# EAGLE design VIVA PIC16 with battery (EAGLE 6.3)

## Sheet 1 of 8
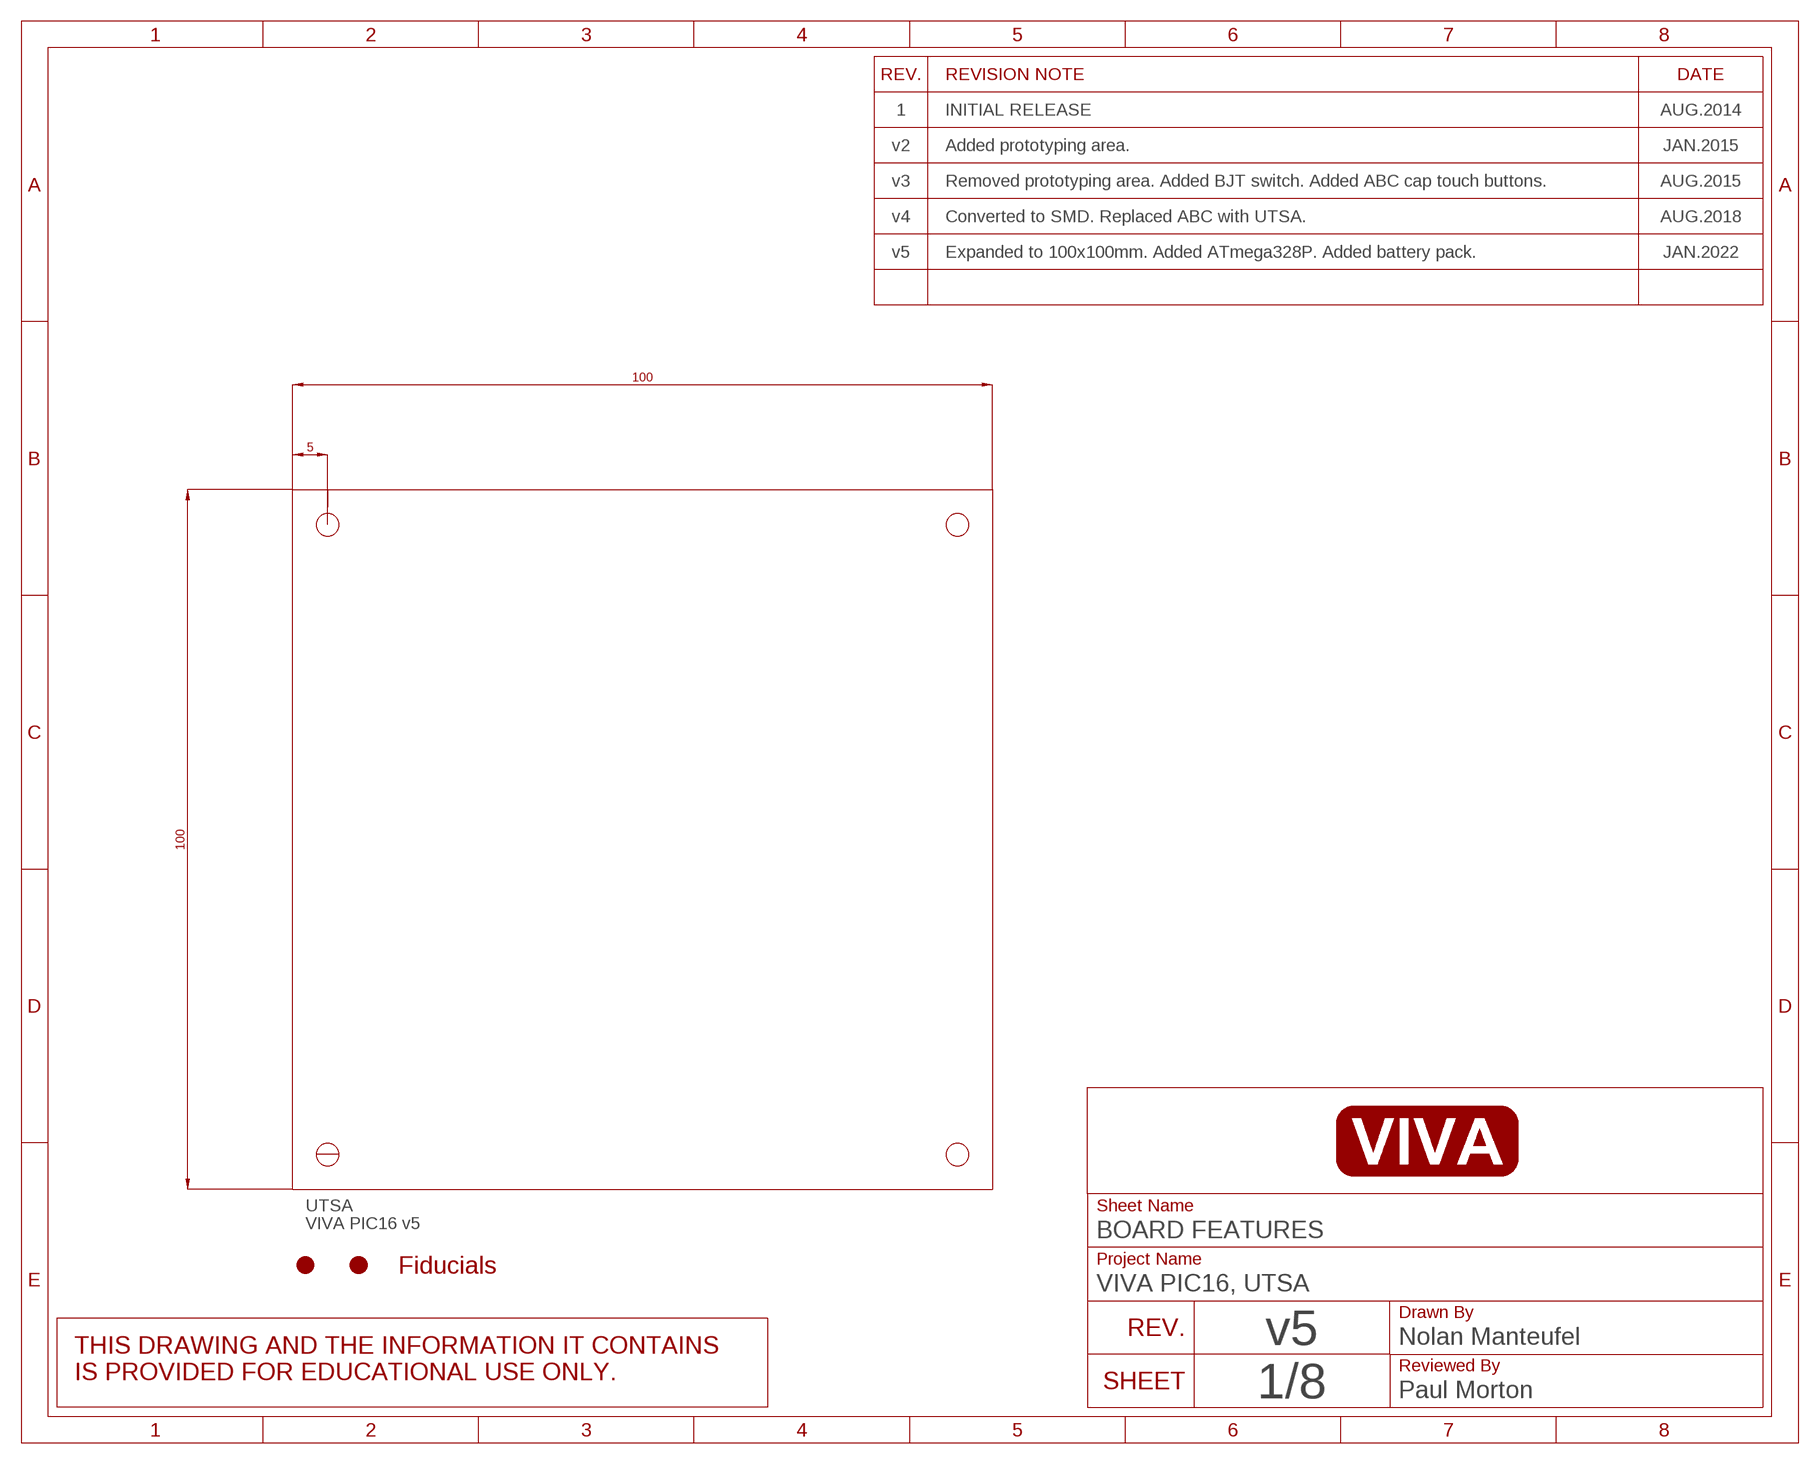
[diagram p0: schematic, sheet 1]
U$1 (SCHEMATIC_VIVA): DRAWN_BY: Nolan Manteufel; PROJECT: VIVA PIC16, UTSA; REVA: 1; REVA_DATE: AUG.2014; REVA_NOTE: INITIAL RELEASE; REVB: v2; REVB_DATE: JAN.2015; REVB_NOTE: Added prototyping area.; REVC: v3; REVC_DATE: AUG.2015; REVC_NOTE: Removed prototyping area. Added BJT switch. Added ABC cap touch buttons.; REVD: v4; REVD_DATE: AUG.2018; REVD_NOTE: Converted to SMD. Replaced ABC with UTSA.; REVE: v5; REVE_DATE: JAN.2022; REVE_NOTE: Expanded to 100x100mm. Added ATmega328P. Added battery pack.; REVIEWED_BY: Paul Morton; REVISION: v5

### Parts
FIDUCIAL1  FIDUCIAL  [FIDUCIAL]
FIDUCIAL2  FIDUCIAL  [FIDUCIAL]
UTSA  VIVA PIC16 v5  PCB_100X100  [PCB_100X100]

### Notes on the sheet
- Fiducials

## Sheet 2 of 8
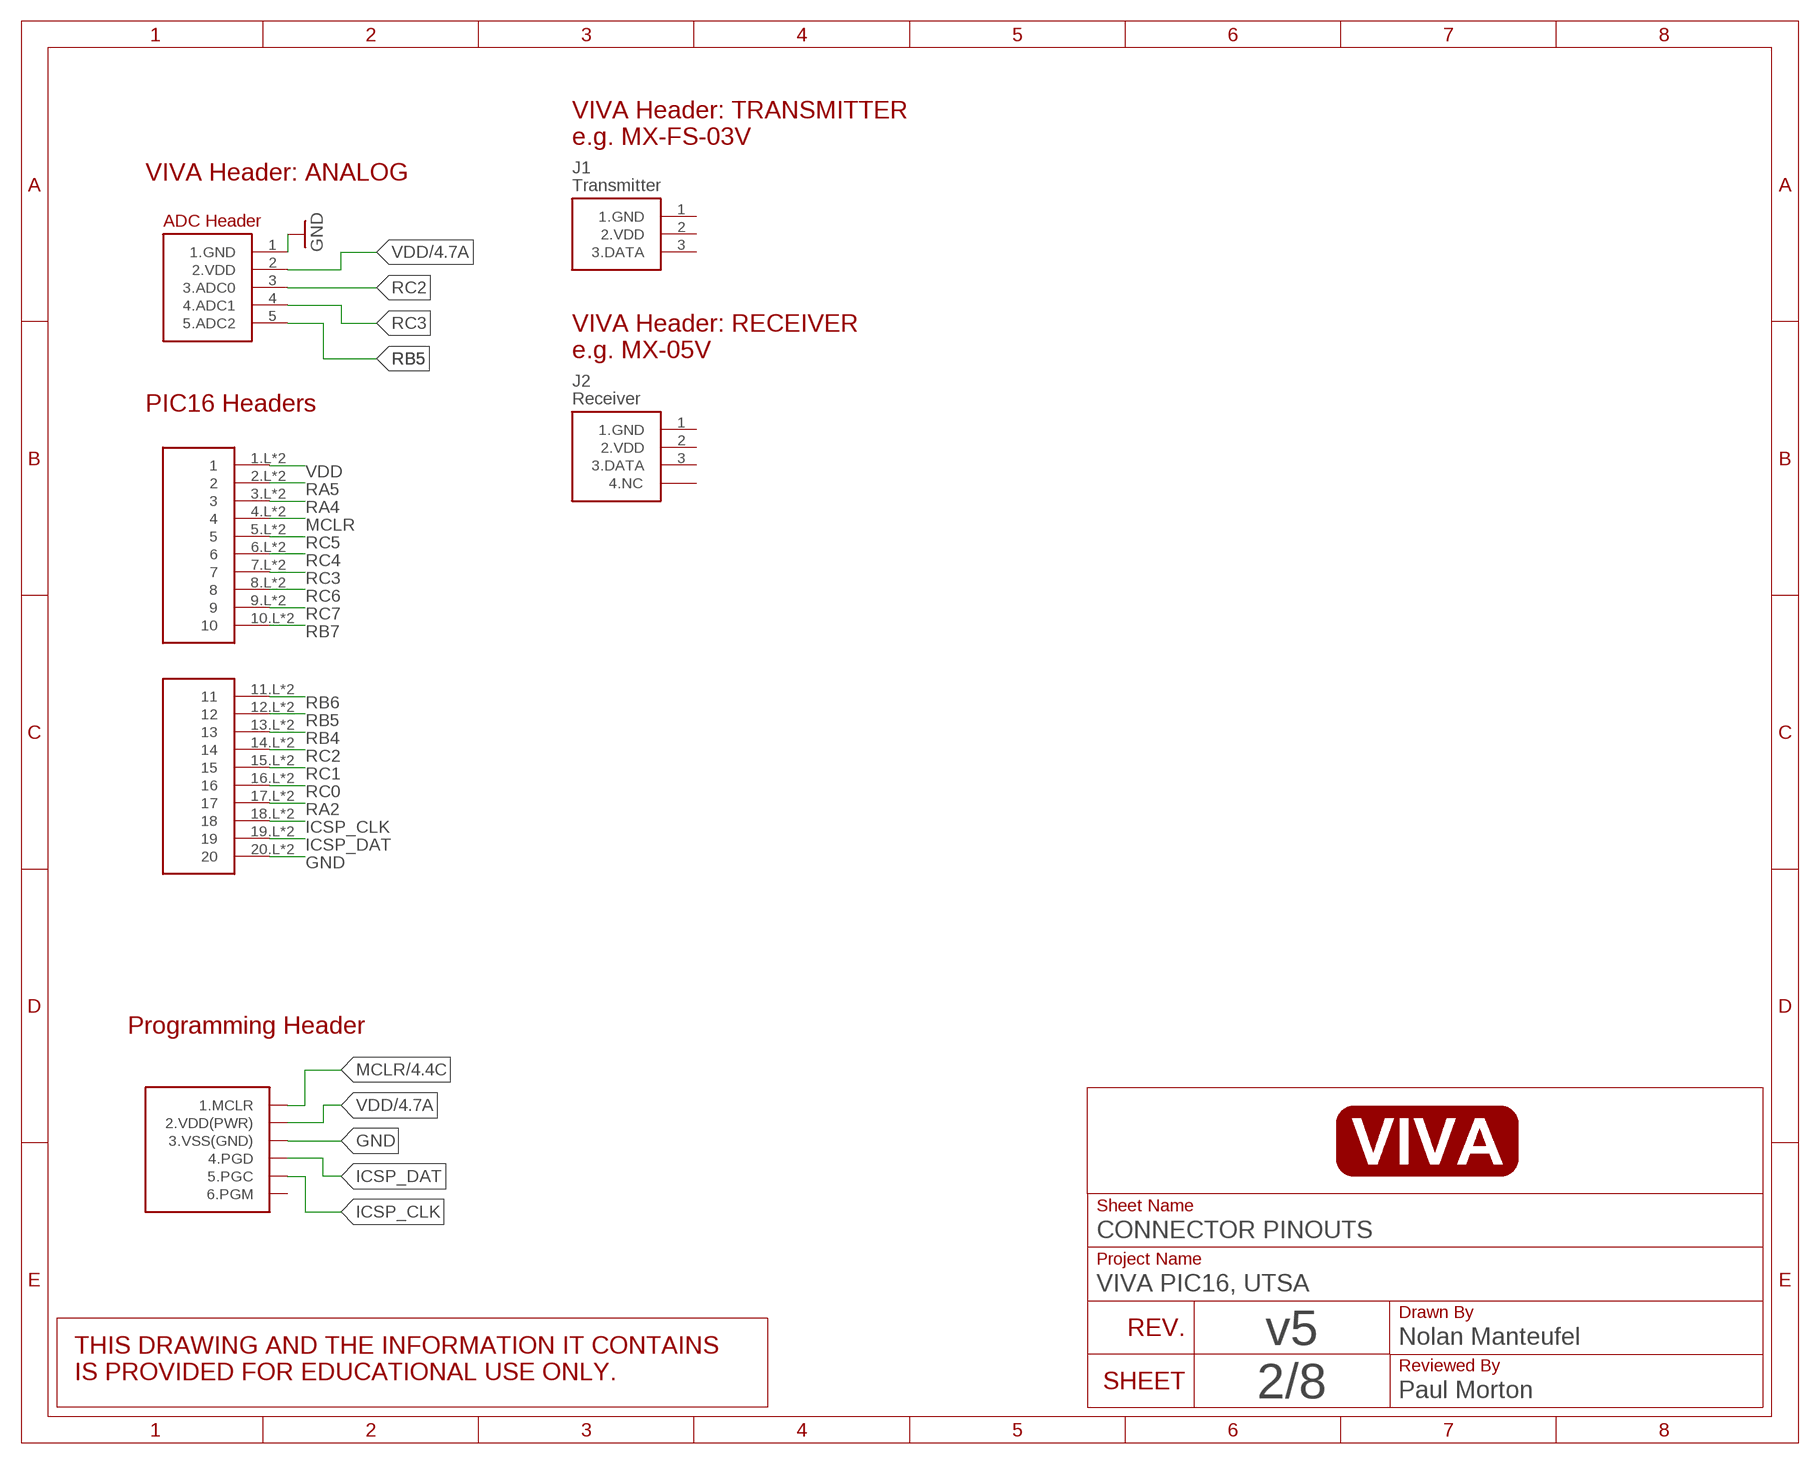
[diagram p1: schematic, sheet 2]
U$2 (SCHEMATIC_VIVA): DRAWN_BY: Nolan Manteufel; PROJECT: VIVA PIC16, UTSA; REVA: 1; REVA_DATE: AUG.2014; REVA_NOTE: INITIAL RELEASE; REVB: v2; REVB_DATE: JAN.2015; REVB_NOTE: Added prototyping area.; REVC: v3; REVC_DATE: AUG.2015; REVC_NOTE: Removed prototyping area. Added BJT switch. Added ABC cap touch buttons.; REVD: v4; REVD_DATE: AUG.2018; REVD_NOTE: Converted to SMD. Replaced ABC with UTSA.; REVE: v5; REVE_DATE: JAN.2022; REVE_NOTE: Expanded to 100x100mm. Added ATmega328P. Added battey pack.; REVIEWED_BY: Paul Morton; REVISION: v5

### Parts
J1  Transmitter  VIVA-HEADER-GPIO-1  [VIVA-HEADER-GPIO-RA-1]
J2  Receiver  VIVA-HEADER-RF-RX  [VIVA-HEADER-RF-RX]
J202  VIVA-HEADER-ADCNONAME  [VIVA-HEADER-ADC-NONAME]
J203  PICKIT3  [PICKIT3]
U$6  VIVA_PIC16BOARD  [VIVA_PIC16]

### Nets
GND: J202.1(1.GND) J203.3(3.VSS(GND)) U$6.20.L U$6.20.R ; also sheet 3,4
ICSP_CLK: J203.5(5.PGC) U$6.18.L U$6.18.R ; also sheet 4
ICSP_DAT: J203.4(4.PGD) U$6.19.L U$6.19.R ; also sheet 4
MCLR: J203.1(1.MCLR) U$6.4.L U$6.4.R ; also sheet 4
RA2: U$6.17.L U$6.17.R ; also sheet 4
RA4: U$6.3.L U$6.3.R ; also sheet 4
RA5: U$6.2.L U$6.2.R ; also sheet 4
RB4: U$6.13.L U$6.13.R ; also sheet 4
RB5: J202.5(5.ADC2) U$6.12.L U$6.12.R ; also sheet 4
RB6: U$6.11.L U$6.11.R ; also sheet 4
RB7: U$6.10.L U$6.10.R ; also sheet 4
RC0: U$6.16.L U$6.16.R ; also sheet 4
RC1: U$6.15.L U$6.15.R ; also sheet 4
RC2: J202.3(3.ADC0) U$6.14.L U$6.14.R ; also sheet 4
RC3: J202.4(4.ADC1) U$6.7.L U$6.7.R ; also sheet 4
RC4: U$6.6.L U$6.6.R ; also sheet 4
RC5: U$6.5.L U$6.5.R ; also sheet 4
RC6: U$6.8.L U$6.8.R ; also sheet 4
RC7: U$6.9.L U$6.9.R ; also sheet 4
VDD: J202.2(2.VDD) J203.2(2.VDD(PWR)) U$6.1.L U$6.1.R ; also sheet 4
Unconnected: J1.1(1.GND) J1.2(2.VDD) J1.3(3.DATA) J2.1(1.GND) J2.2(2.VDD) J2.3(3.DATA) J203.6(6.PGM)

### Notes on the sheet
- VIVA Header: TRANSMITTER
  e.g. MX-FS-03V
- VIVA Header: ANALOG
- VIVA Header: RECEIVER
  e.g. MX-05V
- PIC16 Headers
- Programming Header

## Sheet 3 of 8
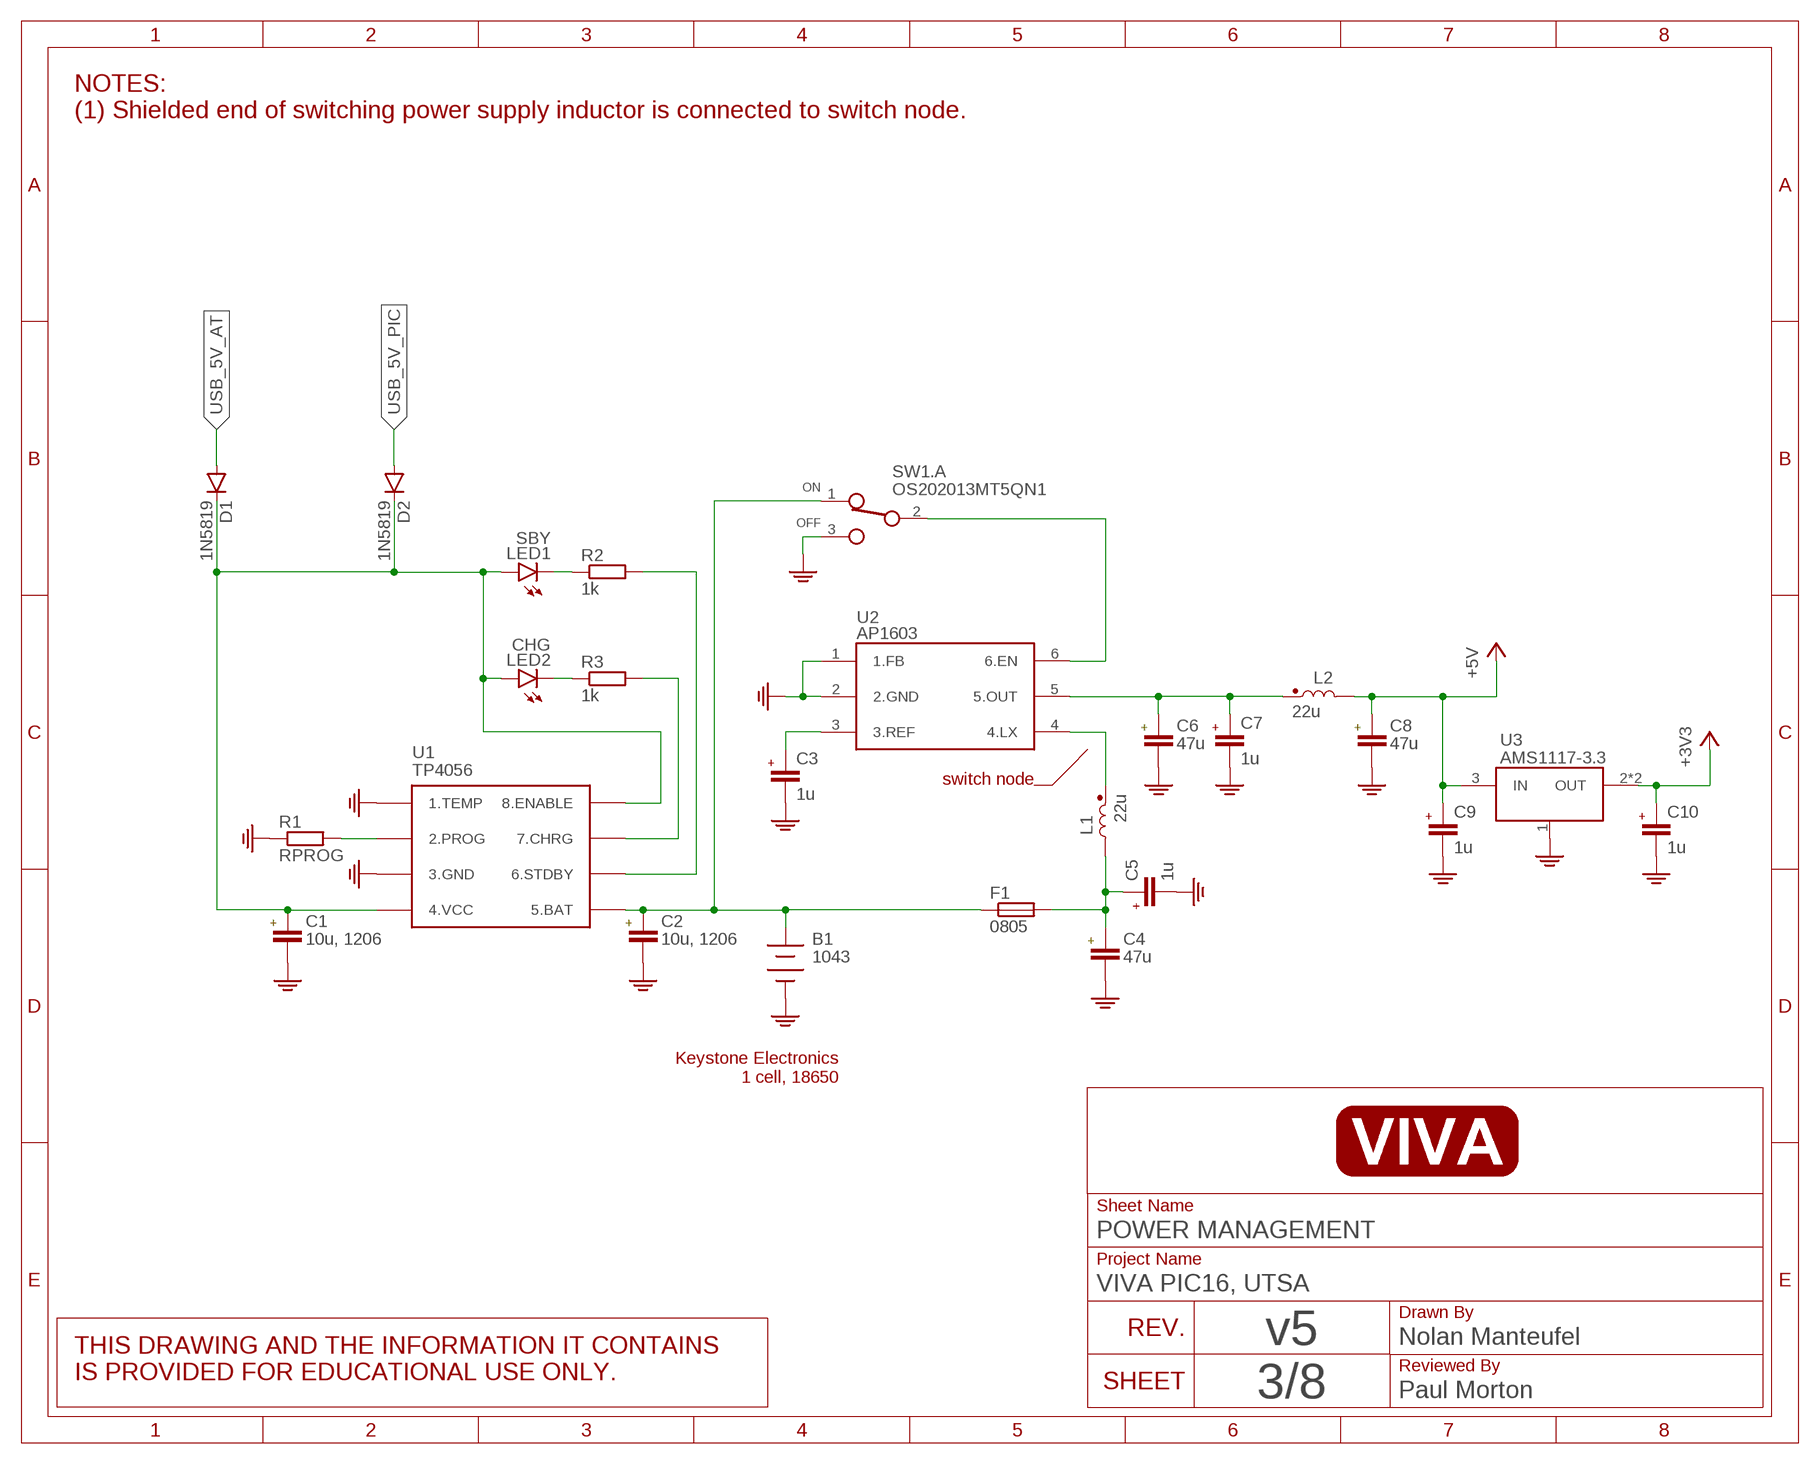
[diagram p2: schematic, sheet 3]
U$3 (SCHEMATIC_VIVA): DRAWN_BY: Nolan Manteufel; PROJECT: VIVA PIC16, UTSA; REVA: 1; REVA_DATE: AUG.2014; REVA_NOTE: INITIAL RELEASE; REVB: v2; REVB_DATE: JAN.2015; REVB_NOTE: Added prototyping area.; REVC: v3; REVC_DATE: AUG.2015; REVC_NOTE: Removed prototyping area. Added BJT switch. Added ABC cap touch buttons.; REVD: v4; REVD_DATE: AUG.2018; REVD_NOTE: Converted to SMD. Replaced ABC with UTSA.; REVE: v5; REVE_DATE: JAN.2022; REVE_NOTE: Expanded to 100x100mm. Added ATmega328P. Added battey pack.; REVIEWED_BY: Paul Morton; REVISION: v5

### Parts
B1  1043  BATTERY18650  [BATTERY-18650-1]
C1  10u, 1206  C-EUC1206  [C1206]
C2  10u, 1206  C-EUC1206  [C1206]
C3  1u  C0805  [C0805]
C4  47u  C-EU865080642006  [C-WE-5MM]
C5  1u  C0805  [C0805]
C6  47u  C-EU865080642006  [C-WE-5MM]
C7  1u  C0805  [C0805]
C8  47u  C-EU865080642006  [C-WE-5MM]
C9  1u  C0805  [C0805]
C10  1u  C0805  [C0805]
D1  1N5819  DIODE-SOD80C  [SOD80C]
D2  1N5819  DIODE-SOD80C  [SOD80C]
F1  0805  FUSE0805  [F0805]
L1  22u  L5040  [SRN5040]
L2  22u  L5040  [SRN5040]
LED1  SBY  LEDCHIPLED_0603  [CHIPLED_0603]
LED2  CHG  LEDCHIPLED_0603  [CHIPLED_0603]
R1  RPROG  R-EU__R0805  [R0805]
R2  1k  R-EU__R0805  [R0805]
R3  1k  R-EU__R0805  [R0805]
SW1.  OS202013MT5QN1  SWITCH_DPDT  [OS202013MT5QN1]
U1  TP4056  [SO08-THERMAL]
U2  AP1603  [SOT23-6]
U3  AMS1117-3.3  REGULATOR_SCHLM1117  [SOT223]

### Nets
+3V3: C10.2(+) U3.2(OUT) U3.4.TAB(OUT)
+5V: C8.1+ C9.2(+) L2.1 U3.3(IN)
B+: B1.+ C2.+ F1.1 SW1..1(A:ON) U1.5(5.BAT)
B+_FUSED: C4.1+ C5.2(+) F1.2 L1.1
CHARGE: R3.2 U1.7(7.CHRG)
DCDC_ENABLE: SW1..2(A:IN) U2.6(6.EN)
DCDC_OUT: C6.1+ C7.2(+) L2.2 U2.5(5.OUT)
DCDC_REF: C3.2(+) U2.3(3.REF)
GND: B1.1(-) C1.- C2.- C3.1(-) C4.2- C5.1(-) C6.2- C7.1(-) C8.2- C9.1(-) C10.1(-) R1.1 SW1..3(A:OFF) U1.1(1.TEMP) U1.3(3.GND) U1.THERMAL(3.GND) U2.1(1.FB) U2.2(2.GND) U3.1(GND) ; also sheet 2,4
N$2: LED1.C R2.1
N$3: LED2.C R3.1
N$7: R1.2 U1.2(2.PROG)
STANDBY: R2.2 U1.6(6.STDBY)
SWITCH_NODE: L1.2 U2.4(4.LX)
USB_5V_AT: D1.A
USB_5V_PIC: D2.A
VCC: C1.+ D1.C D2.C LED1.A LED2.A U1.4(4.VCC) U1.8(8.ENABLE)
Unconnected: SW1..4(B:ON) SW1..5(B:IN) SW1..6(B:OFF)

### Notes on the sheet
- NOTES:
  (1) Shielded end of switching power supply inductor is connected to switch node.
- switch node
- Keystone Electronics
  1 cell, 18650

## Sheet 4 of 8
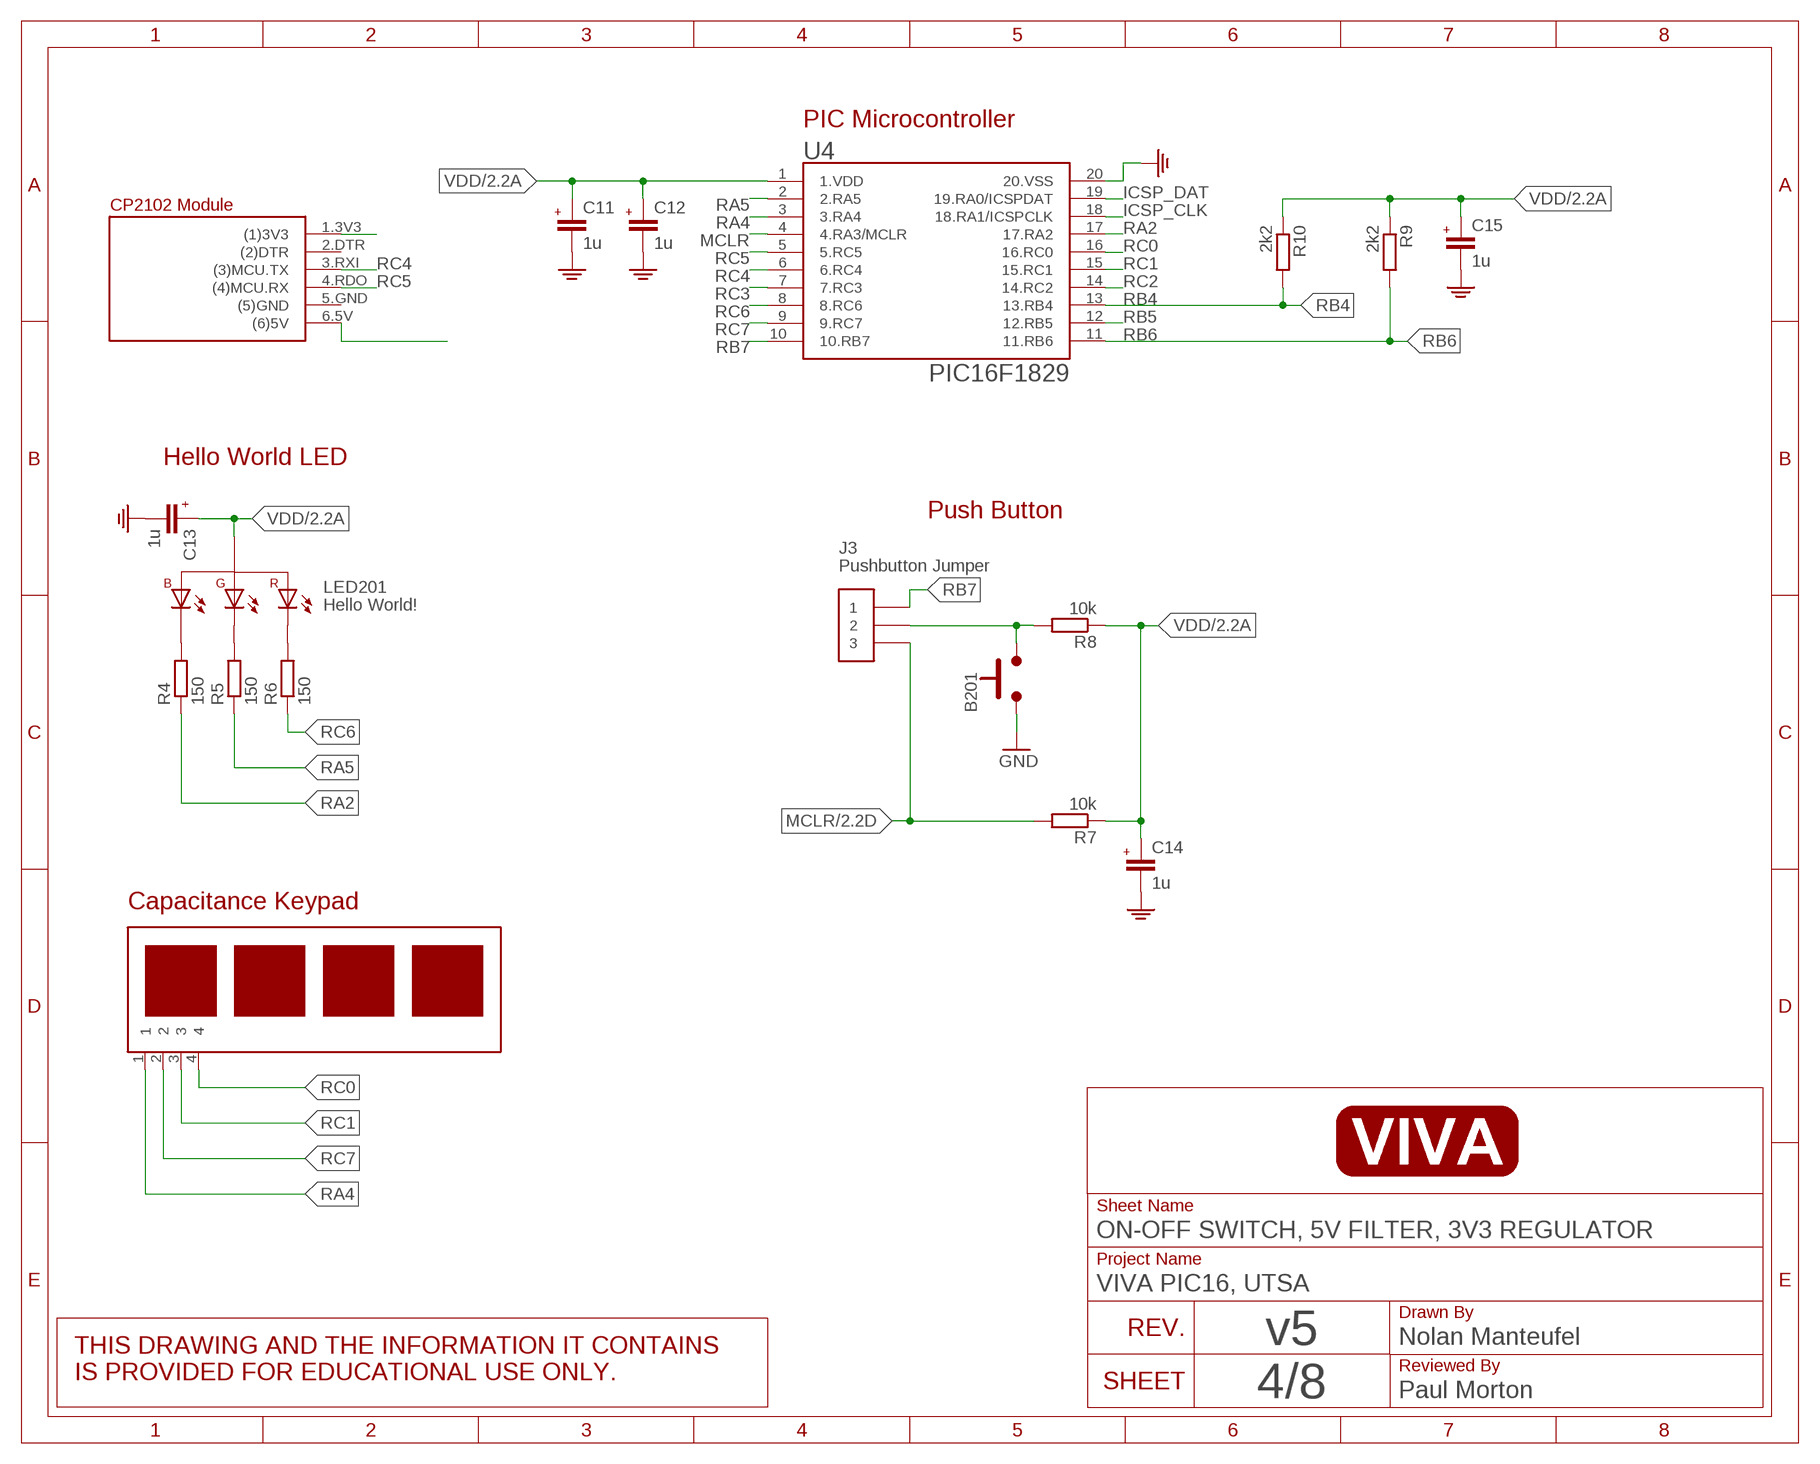
[diagram p3: schematic, sheet 4]
U$4 (SCHEMATIC_VIVA): DRAWN_BY: Nolan Manteufel; PROJECT: VIVA PIC16, UTSA; REVA: 1; REVA_DATE: AUG.2014; REVA_NOTE: INITIAL RELEASE; REVB: v2; REVB_DATE: JAN.2015; REVB_NOTE: Added prototyping area.; REVC: v3; REVC_DATE: AUG.2015; REVC_NOTE: Removed prototyping area. Added BJT switch. Added ABC cap touch buttons.; REVD: v4; REVD_DATE: AUG.2018; REVD_NOTE: Converted to SMD. Replaced ABC with UTSA.; REVE: v5; REVE_DATE: JAN.2022; REVE_NOTE: Expanded to 100x100mm. Added ATmega328P. Added battey pack.; REVIEWED_BY: Paul Morton; REVISION: v5

### Parts
B201  PUSHBUTTON6X6MM  [6X6MM]
C11  1u  C0805  [C0805]
C12  1u  C0805  [C0805]
C13  1u  C0805  [C0805]
C14  1u  C0805  [C0805]
C15  1u  C0805  [C0805]
J3  Pushbutton Jumper  PINS_3_2.54  [PINS_3]
LED201  Hello World!  RGB_LED  [LED_RGB-5050]
R4  150  R-EU__R0805  [R0805]
R5  150  R-EU__R0805  [R0805]
R6  150  R-EU__R0805  [R0805]
R7  10k  R-EU__R0805  [R0805]
R8  10k  R-EU__R0805  [R0805]
R9  2k2  R-EU__R0805  [R0805]
R10  2k2  R-EU__R0805  [R0805]
U4  PIC16F1829  PIC16F1829300  [SOP20-NEW]
U$7  VIVA_UTSA-KEYPADV5  [VIVA_UTSA-KEYPAD-V5]
U$11  VIVA_USB-TTL  [VIVA_USB_TTL_SUBTEXT]

### Nets
GND: B201.1.A B201.2.A C11.1(-) C12.1(-) C13.1(-) C14.1(-) C15.1(-) U4.20(20.VSS) ; also sheet 2,3
ICSP_CLK: U4.18(18.RA1/ICSPCLK) ; also sheet 2
ICSP_DAT: U4.19(19.RA0/ICSPDAT) ; also sheet 2
MCLR: J3.3 R7.2 U4.4(4.RA3/MCLR) ; also sheet 2
N$1: B201.3.B B201.4.B J3.2 R8.2
N$4: LED201.2.G- R5.2
N$5: LED201.1.R- R6.2
N$6: LED201.4.B- R4.2
N$14: U$11.1.3V3((1)3V3)
N$16: U$11.6.5V((6)5V)
RA2: R4.1 U4.17(17.RA2) ; also sheet 2
RA4: U4.3(3.RA4) U$7.1 ; also sheet 2
RA5: R5.1 U4.2(2.RA5) ; also sheet 2
RB4: R10.2 U4.13(13.RB4) ; also sheet 2
RB5: U4.12(12.RB5) ; also sheet 2
RB6: R9.2 U4.11(11.RB6) ; also sheet 2
RB7: J3.1 U4.10(10.RB7) ; also sheet 2
RC0: U4.16(16.RC0) U$7.4 ; also sheet 2
RC1: U4.15(15.RC1) U$7.3 ; also sheet 2
RC2: U4.14(14.RC2) ; also sheet 2
RC3: U4.7(7.RC3) ; also sheet 2
RC4: U4.6(6.RC4) U$11.3.RXI((3)MCU.TX) ; also sheet 2
RC5: U4.5(5.RC5) U$11.4.RDO((4)MCU.RX) ; also sheet 2
RC6: R6.1 U4.8(8.RC6) ; also sheet 2
RC7: U4.9(9.RC7) U$7.2 ; also sheet 2
VDD: C11.2(+) C12.2(+) C13.2(+) C14.2(+) C15.2(+) LED201.3.+ R7.1 R8.1 R9.1 R10.1 U4.1(1.VDD) ; also sheet 2
Unconnected: U$11.2.DTR((2)DTR) U$11.5.GND((5)GND)

### Notes on the sheet
- PIC Microcontroller
- Hello World LED
- Push Button
- Capacitance Keypad

## Sheet 5 of 8
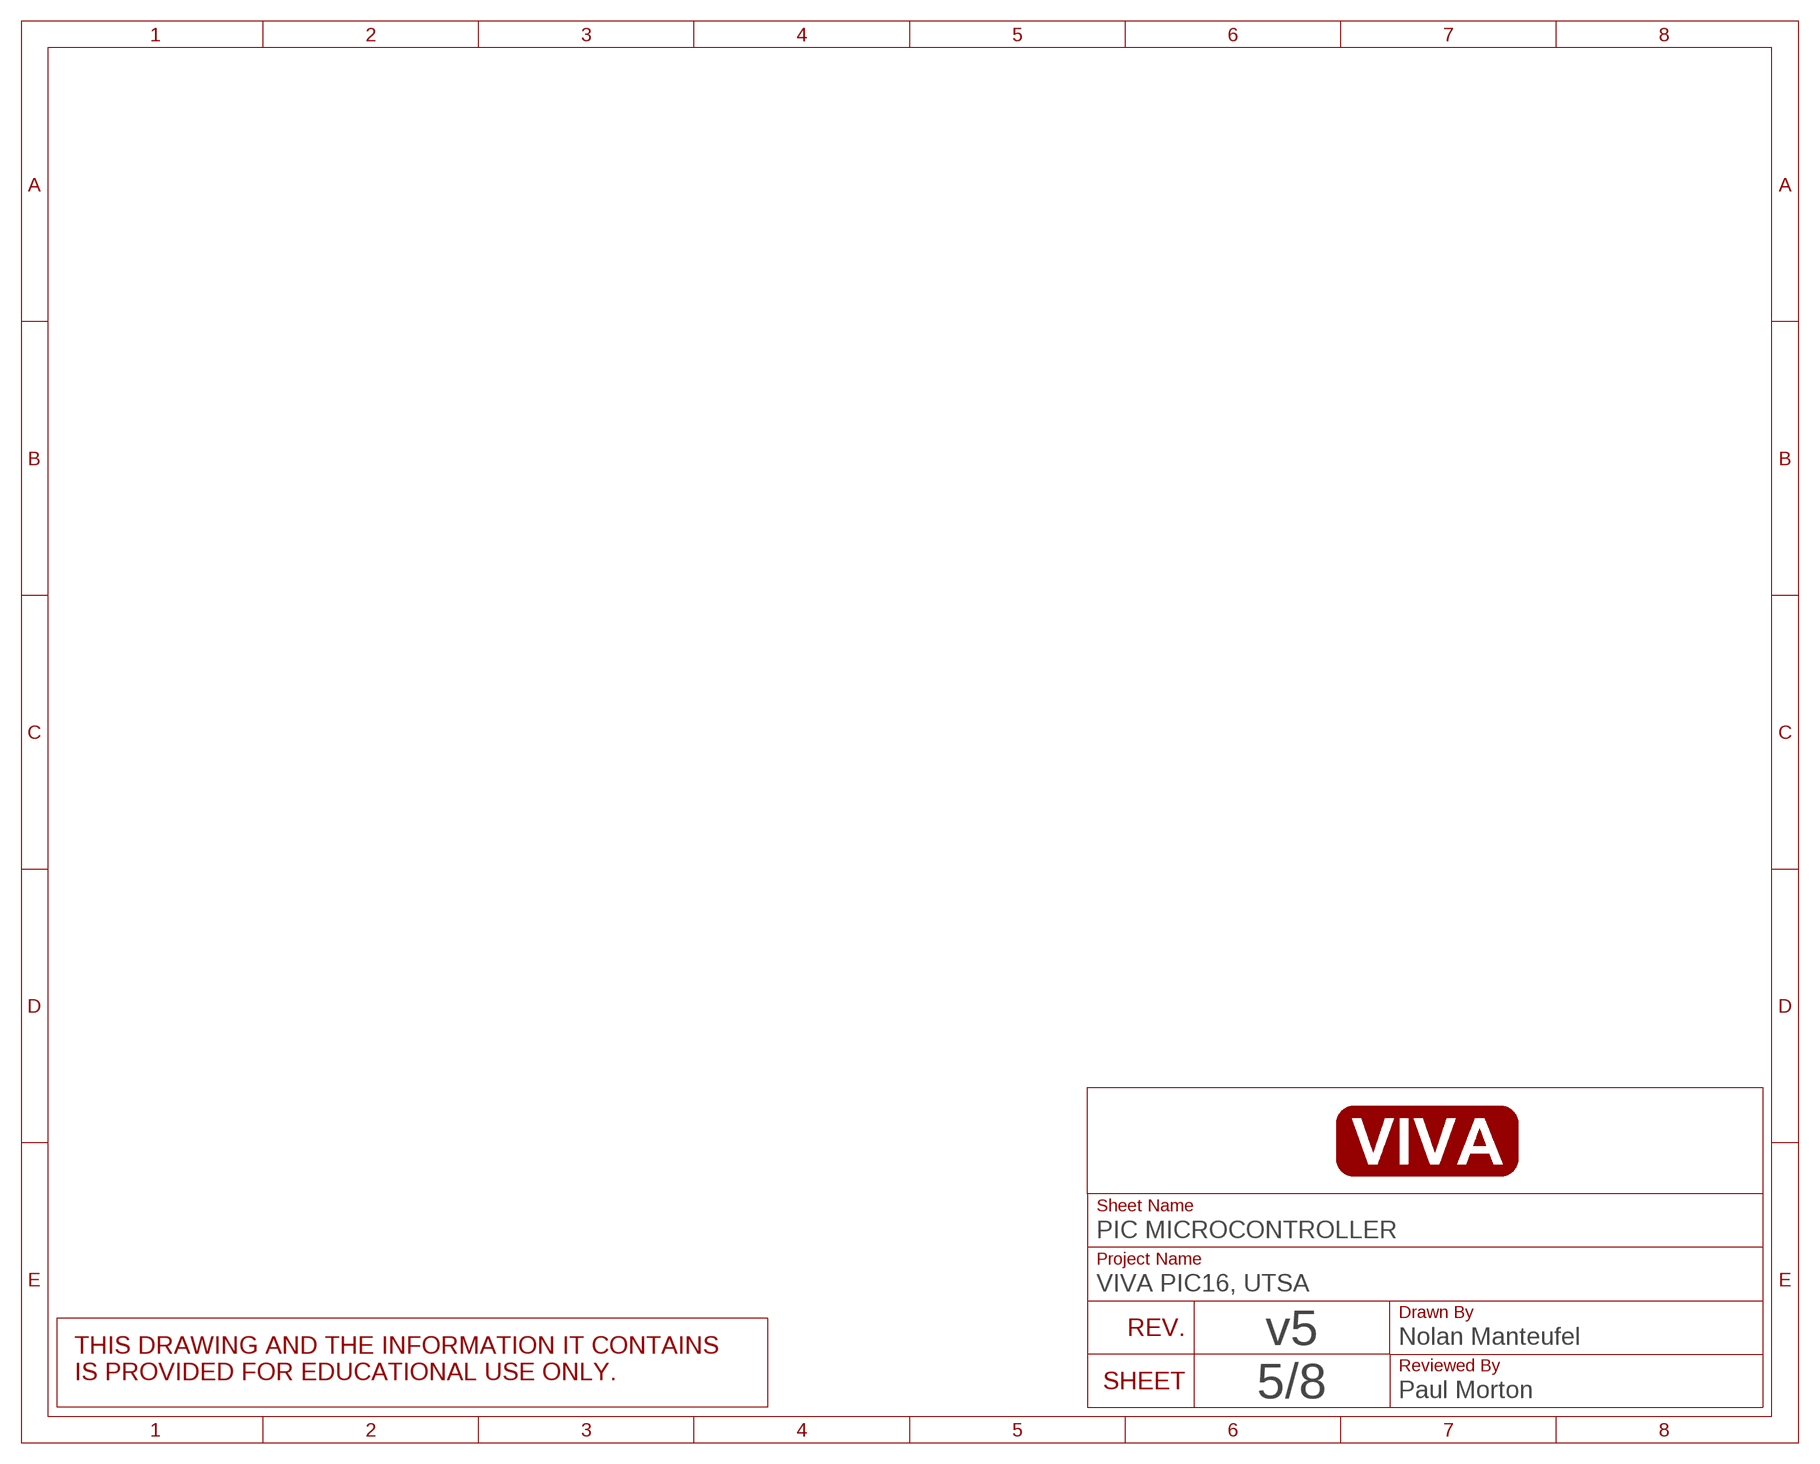
[diagram p4: schematic, sheet 5]
U$5 (SCHEMATIC_VIVA): DRAWN_BY: Nolan Manteufel; PROJECT: VIVA PIC16, UTSA; REVA: 1; REVA_DATE: AUG.2014; REVA_NOTE: INITIAL RELEASE; REVB: v2; REVB_DATE: JAN.2015; REVB_NOTE: Added prototyping area.; REVC: v3; REVC_DATE: AUG.2015; REVC_NOTE: Removed prototyping area. Added BJT switch. Added ABC cap touch buttons.; REVD: v4; REVD_DATE: AUG.2018; REVD_NOTE: Converted to SMD. Replaced ABC with UTSA.; REVE: v5; REVE_DATE: JAN.2022; REVE_NOTE: Expanded to 100x100mm. Added ATmega328P. Added battey pack.; REVIEWED_BY: Paul Morton; REVISION: v5

## Sheet 6 of 8
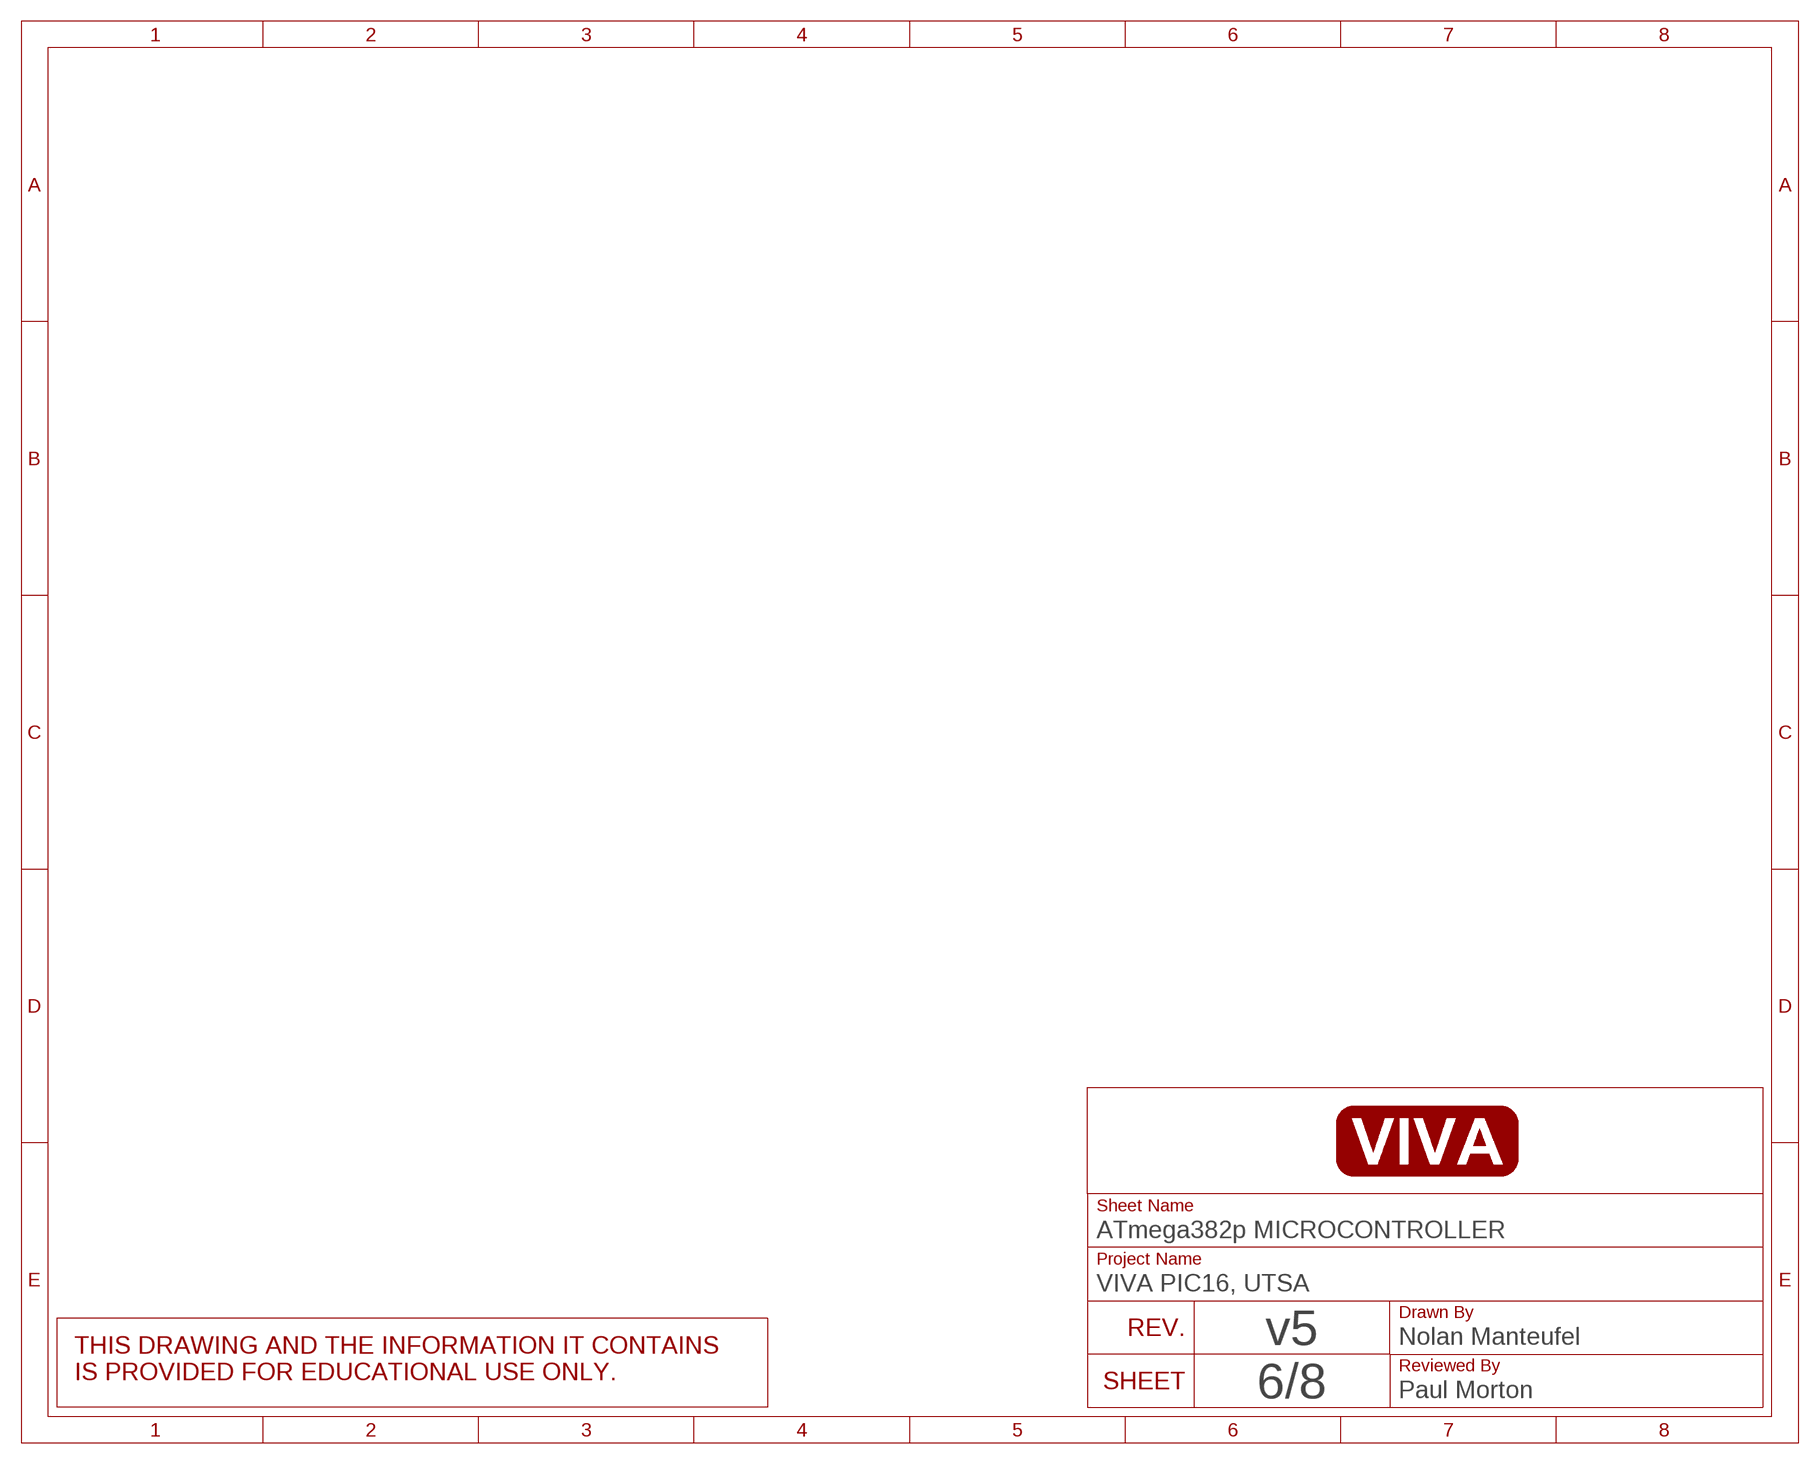
[diagram p5: schematic, sheet 6]
U$8 (SCHEMATIC_VIVA): DRAWN_BY: Nolan Manteufel; PROJECT: VIVA PIC16, UTSA; REVA: 1; REVA_DATE: AUG.2014; REVA_NOTE: INITIAL RELEASE; REVB: v2; REVB_DATE: JAN.2015; REVB_NOTE: Added prototyping area.; REVC: v3; REVC_DATE: AUG.2015; REVC_NOTE: Removed prototyping area. Added BJT switch. Added ABC cap touch buttons.; REVD: v4; REVD_DATE: AUG.2018; REVD_NOTE: Converted to SMD. Replaced ABC with UTSA.; REVE: v5; REVE_DATE: JAN.2022; REVE_NOTE: Expanded to 100x100mm. Added ATmega328P. Added battey pack.; REVIEWED_BY: Paul Morton; REVISION: v5

## Sheet 7 of 8
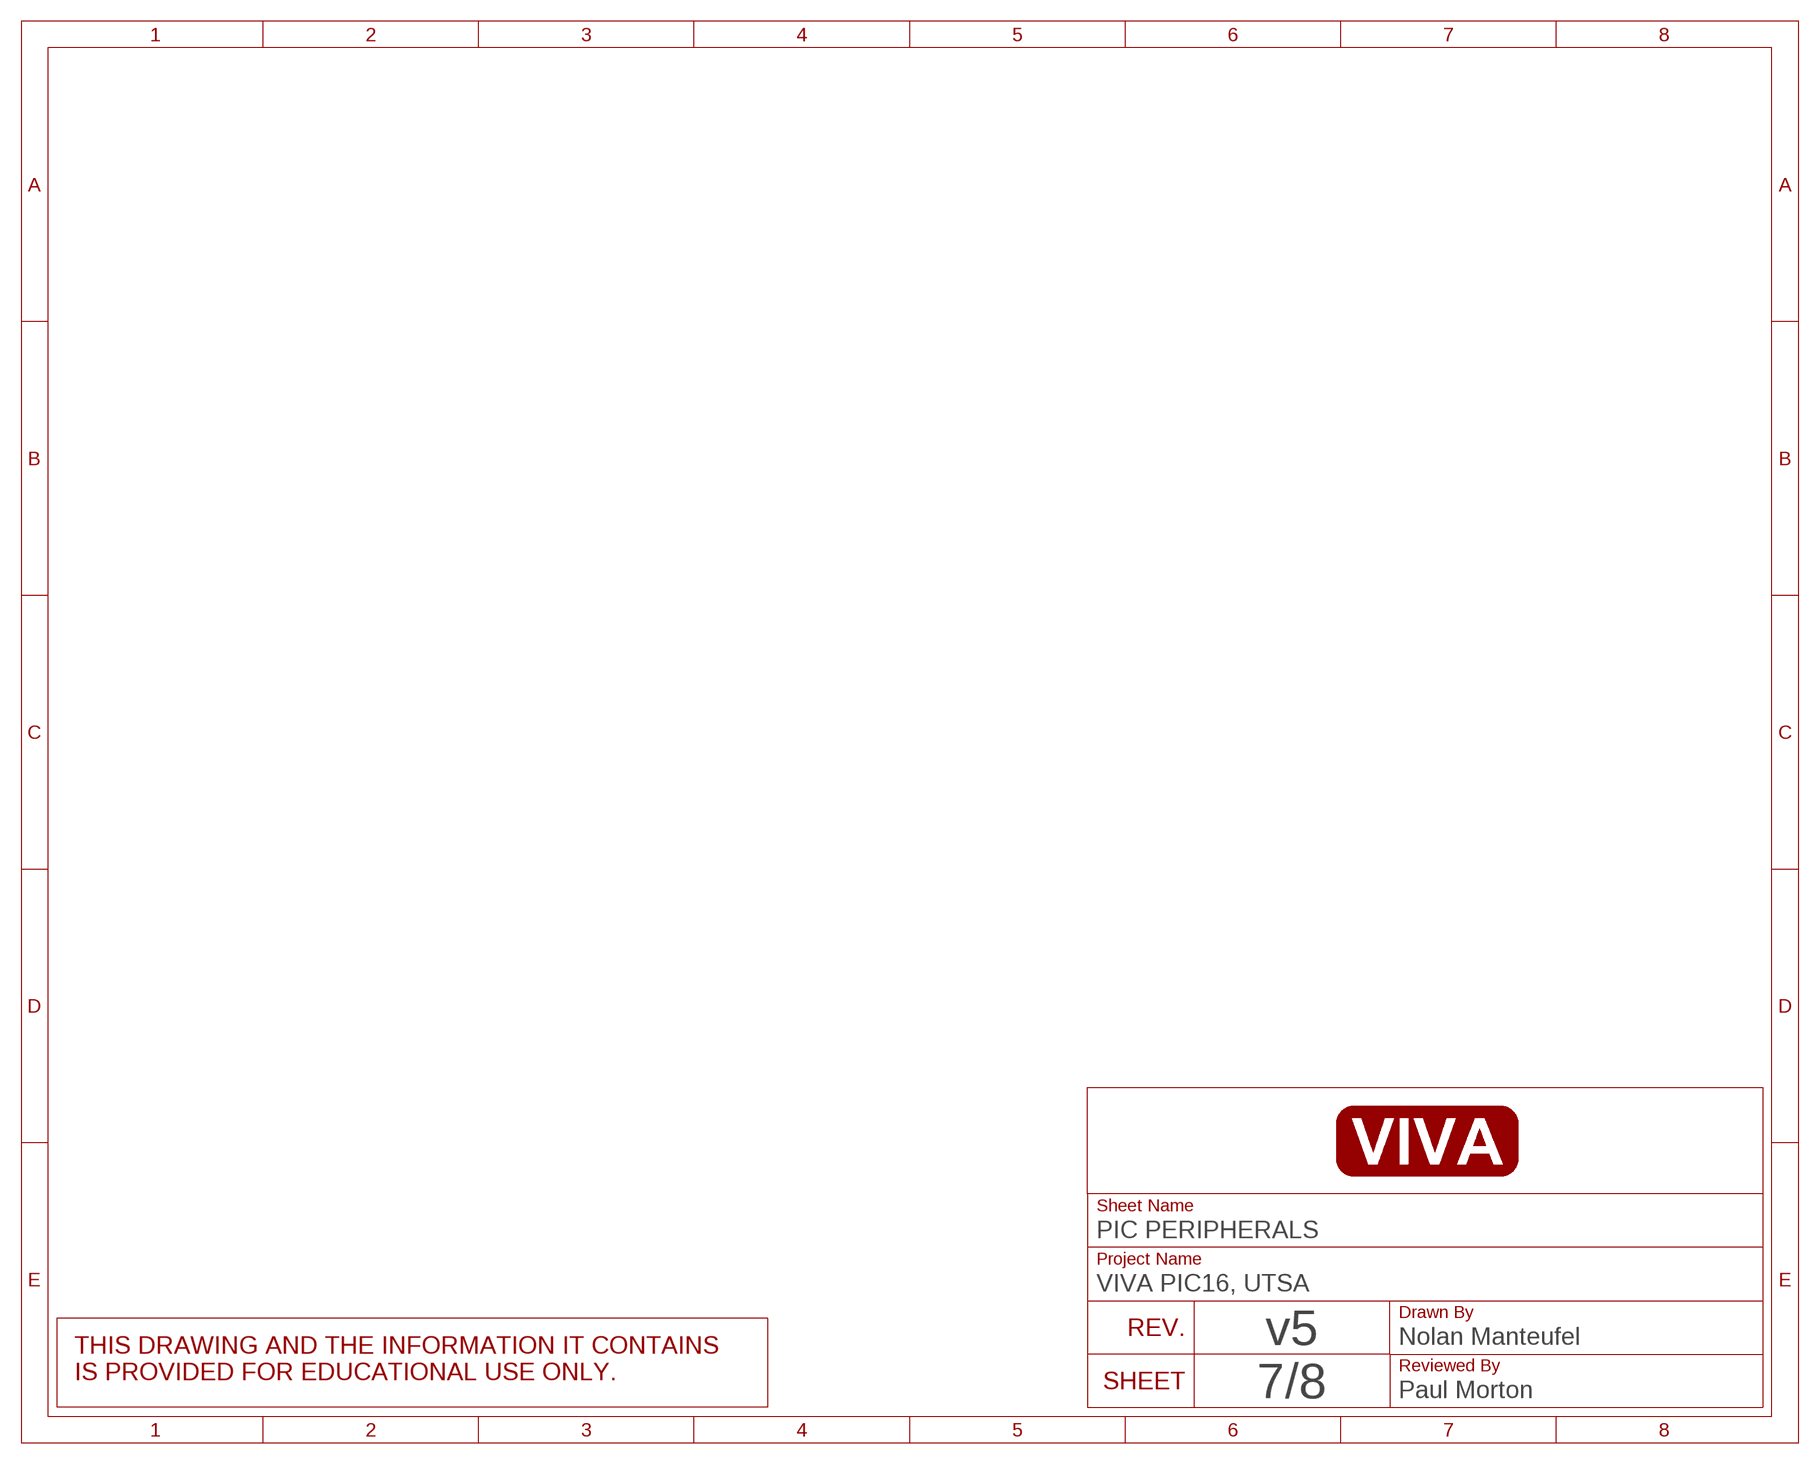
[diagram p6: schematic, sheet 7]
U$9 (SCHEMATIC_VIVA): DRAWN_BY: Nolan Manteufel; PROJECT: VIVA PIC16, UTSA; REVA: 1; REVA_DATE: AUG.2014; REVA_NOTE: INITIAL RELEASE; REVB: v2; REVB_DATE: JAN.2015; REVB_NOTE: Added prototyping area.; REVC: v3; REVC_DATE: AUG.2015; REVC_NOTE: Removed prototyping area. Added BJT switch. Added ABC cap touch buttons.; REVD: v4; REVD_DATE: AUG.2018; REVD_NOTE: Converted to SMD. Replaced ABC with UTSA.; REVE: v5; REVE_DATE: JAN.2022; REVE_NOTE: Expanded to 100x100mm. Added ATmega328P. Added battey pack.; REVIEWED_BY: Paul Morton; REVISION: v5

## Sheet 8 of 8
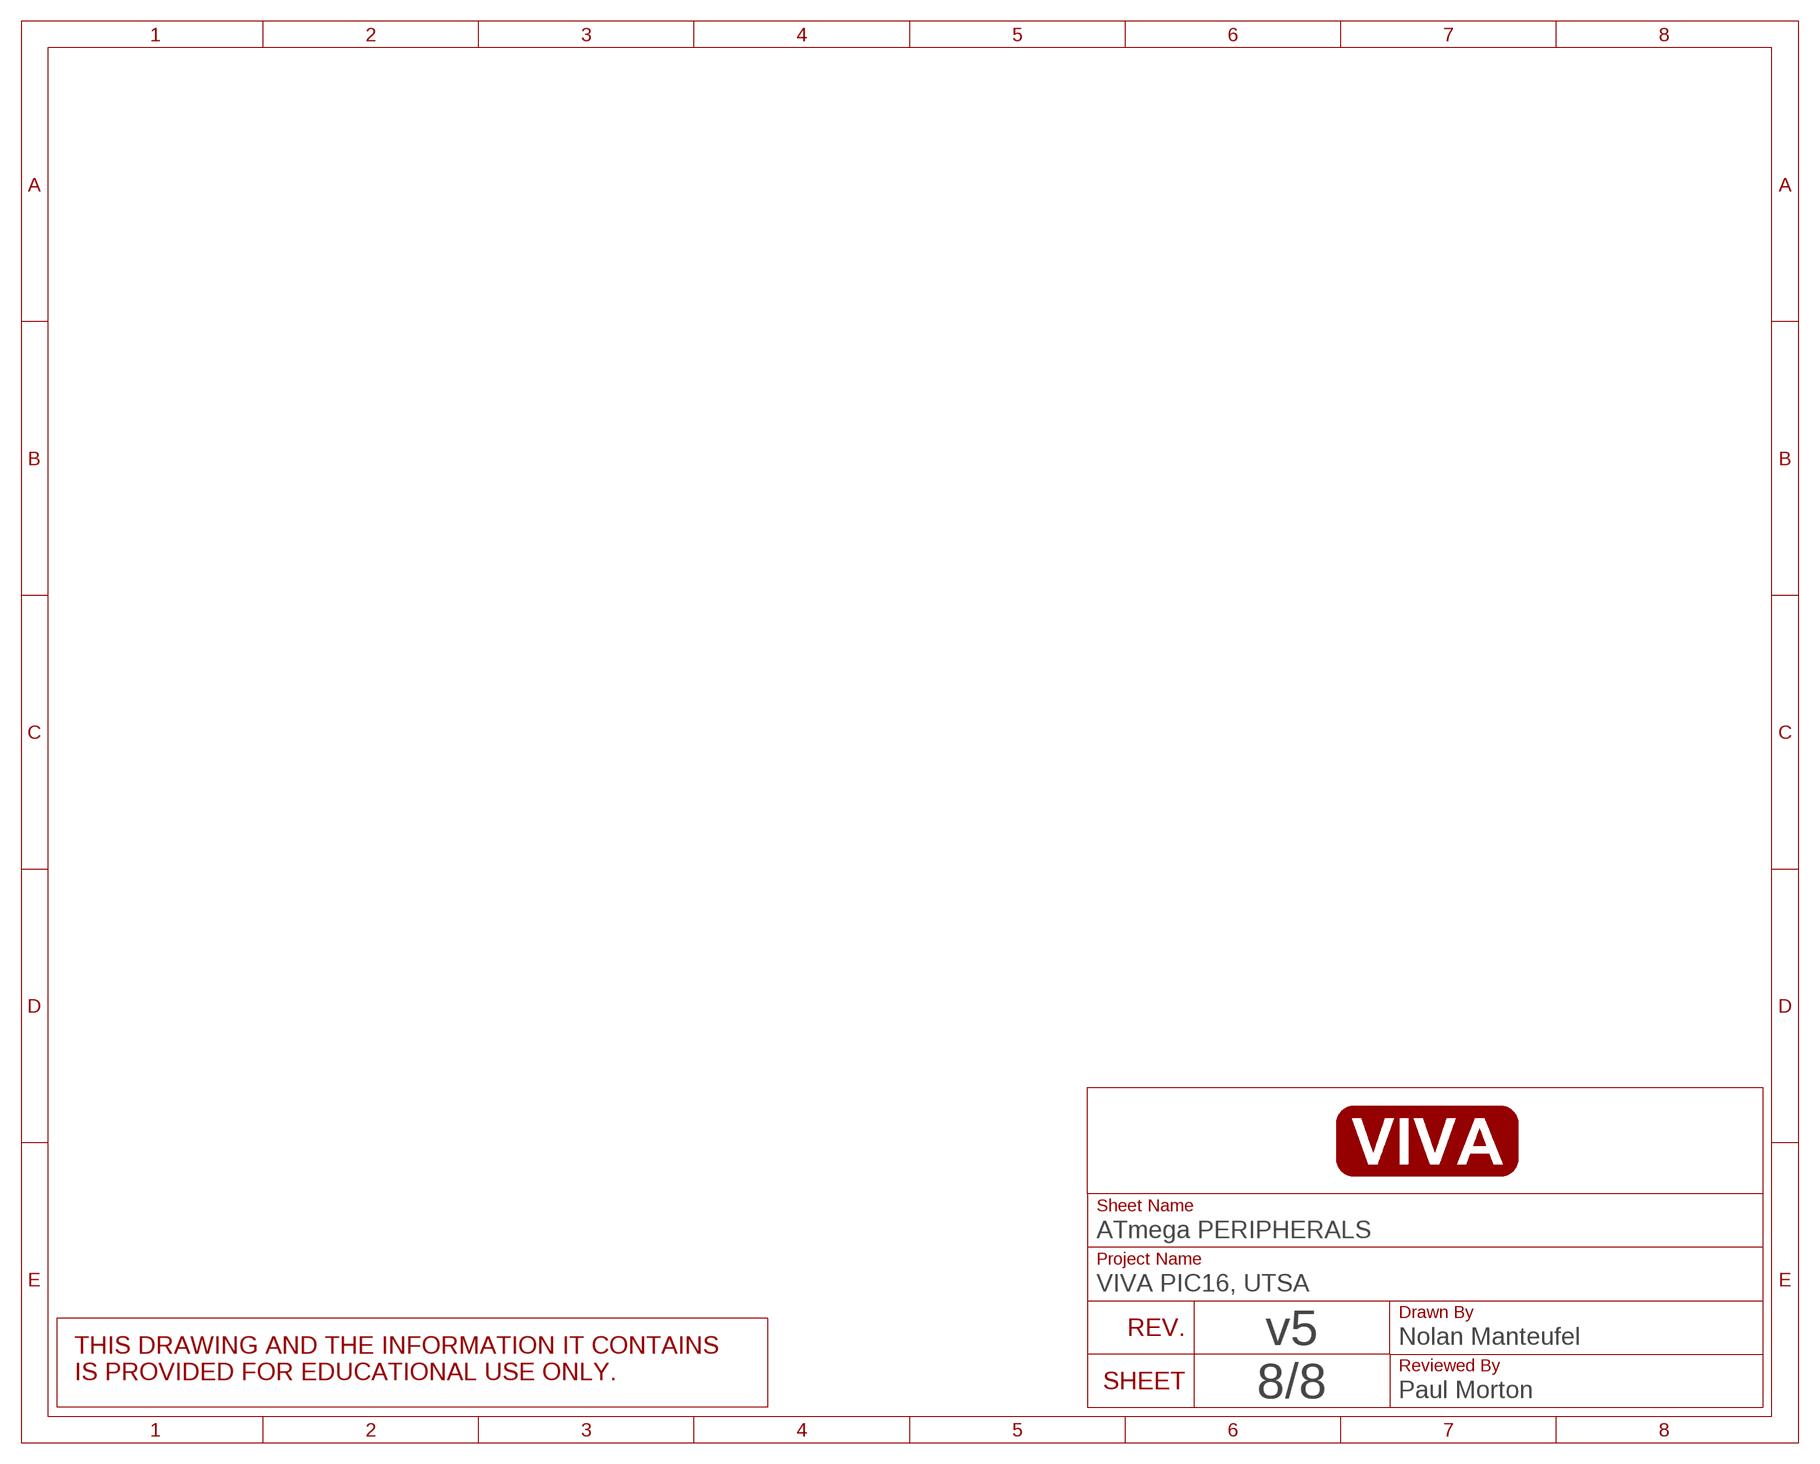
[diagram p7: schematic, sheet 8]
U$10 (SCHEMATIC_VIVA): DRAWN_BY: Nolan Manteufel; PROJECT: VIVA PIC16, UTSA; REVA: 1; REVA_DATE: AUG.2014; REVA_NOTE: INITIAL RELEASE; REVB: v2; REVB_DATE: JAN.2015; REVB_NOTE: Added prototyping area.; REVC: v3; REVC_DATE: AUG.2015; REVC_NOTE: Removed prototyping area. Added BJT switch. Added ABC cap touch buttons.; REVD: v4; REVD_DATE: AUG.2018; REVD_NOTE: Converted to SMD. Replaced ABC with UTSA.; REVE: v5; REVE_DATE: JAN.2022; REVE_NOTE: Expanded to 100x100mm. Added ATmega328P. Added battey pack.; REVIEWED_BY: Paul Morton; REVISION: v5

## Library data of the parts
B1 = utsa:BATTERY: 2xAAA battery holder for VIVA
B201 = nolan-utsa:PUSHBUTTON: Tactile push button switch
C1 C2 C4 C6 C8 = utsa:C-EU: CAPACITOR, European symbol
C3 C5 C7 C9-C15 = utsa:C
D1 D2 = utsa:DIODE-: DIODE
F1 = utsa:FUSE
FIDUCIAL1 FIDUCIAL2 = utsa:FIDUCIAL
J1 = utsa:VIVA-HEADER-GPIO-1
J2 = utsa:VIVA-HEADER-RF-RX
J3 = utsa:PINS_3
J202 = nolan-utsa:VIVA-HEADER-ADC
J203 = nolan-viva:PICKIT3
L1 L2 = utsa:L
LED1 LED2 = utsa:LED: LED OSRAM: - CHIPLED LG R971, LG N971, LY N971, LG Q971, LY Q971, LO R971, LY R971 LH N974, LH R974 LS Q976, LO Q976, LY Q976 LO Q996 - Hyper CHIPLED LW Q18S LB Q993, LB Q99A, LB R99A - SideLED LS A670, LO A670, LY A670, LG A670, LP A670 LB A673, LV A673, LT A673, LW A673 LH A674 LY A675 LS A676, LA A676, LO A676, LY A676, LW A676 LS A679, LY A679, LG A679 - Hyper Micro SIDELED® LS Y876, LA Y876, LO Y876, LY Y876 LT Y87S - SmartLED LW L88C, LW L88S LB L89C, LB L89S, LG L890 LS L89K, LO L89K, LY L89K LS L896, LA L896, LO L896, LY L896 - TOPLED LS T670, LO T670, LY T670, LG T670, LP T670 LSG T670, LSP T670, LSY T670, LOP T670, LYG T670 LG T671, LOG T671, LSG T671 LB T673, LV T673, LT T673, LW T673 LH T674 LS T676, LA T676, LO T676, LY T676, LB T676, LH T676, LSB T676, LW T676 LB T67C, LV T67C, LT T67C, LS T67K, LO T67K, LY T67K, LW E67C LS E67B, LA E67B, LO E67B, LY E67B, LB E67C, LV E67C, LT E67C LW T67C LS T679, LY T679, LG T679 LS T770, LO T770, LY T770, LG T770, LP T770 LB T773, LV T773, LT T773, LW T773 LH T774 LS E675, LA E675, LY E675, LS T675 LS T776, LA T776, LO T776, LY T776, LB T776 LHGB T686 LT T68C, LB T68C - Hyper Mini TOPLED® LB M676 - Mini TOPLED Santana® LG M470 LS M47K, LO M47K, LY M47K Source: http://www.osram.convergy.de LUXEON: - LUMILED® LXK2-PW12-R00, LXK2-PW12-S00, LXK2-PW14-U00, LXK2-PW14-V00 LXK2-PM12-R00, LXK2-PM12-S00, LXK2-PM14-U00 LXK2-PE12-Q00, LXK2-PE12-R00, LXK2-PE12-S00, LXK2-PE14-T00, LXK2-PE14-U00 LXK2-PB12-K00, LXK2-PB12-L00, LXK2-PB12-M00, LXK2-PB14-N00, LXK2-PB14-P00, LXK2-PB14-Q00 LXK2-PR12-L00, LXK2-PR12-M00, LXK2-PR14-Q00, LXK2-PR14-R00 LXK2-PD12-Q00, LXK2-PD12-R00, LXK2-PD12-S00 LXK2-PH12-R00, LXK2-PH12-S00 LXK2-PL12-P00, LXK2-PL12-Q00, LXK2-PL12-R00 Source: www.luxeon.com KINGBRIGHT: KA-3528ASYC Source: www.kingbright.com
LED201 = nolan-utsa:RGB_LED
R1-R10 = utsa:R-EU_: RESISTOR, European symbol
SW1. = utsa:SWITCH_DPDT
U1 = utsa:TP4056
U2 = utsa:AP1603: STEP-UP DC-DC CONVERTER
U3 = utsa:REGULATOR_SCH: Linear Regulator in SOT-223 package. NOTE: select correct pinout for your application. Tab may be OUT or GND!
U4 = utsa:PIC16F1829
U$6 = utsa:VIVA_PIC16
U$7 = utsa:VIVA_UTSA-KEYPAD
U$11 = utsa:VIVA_USB-TTL
UTSA = utsa:PCB_100X100

## Board
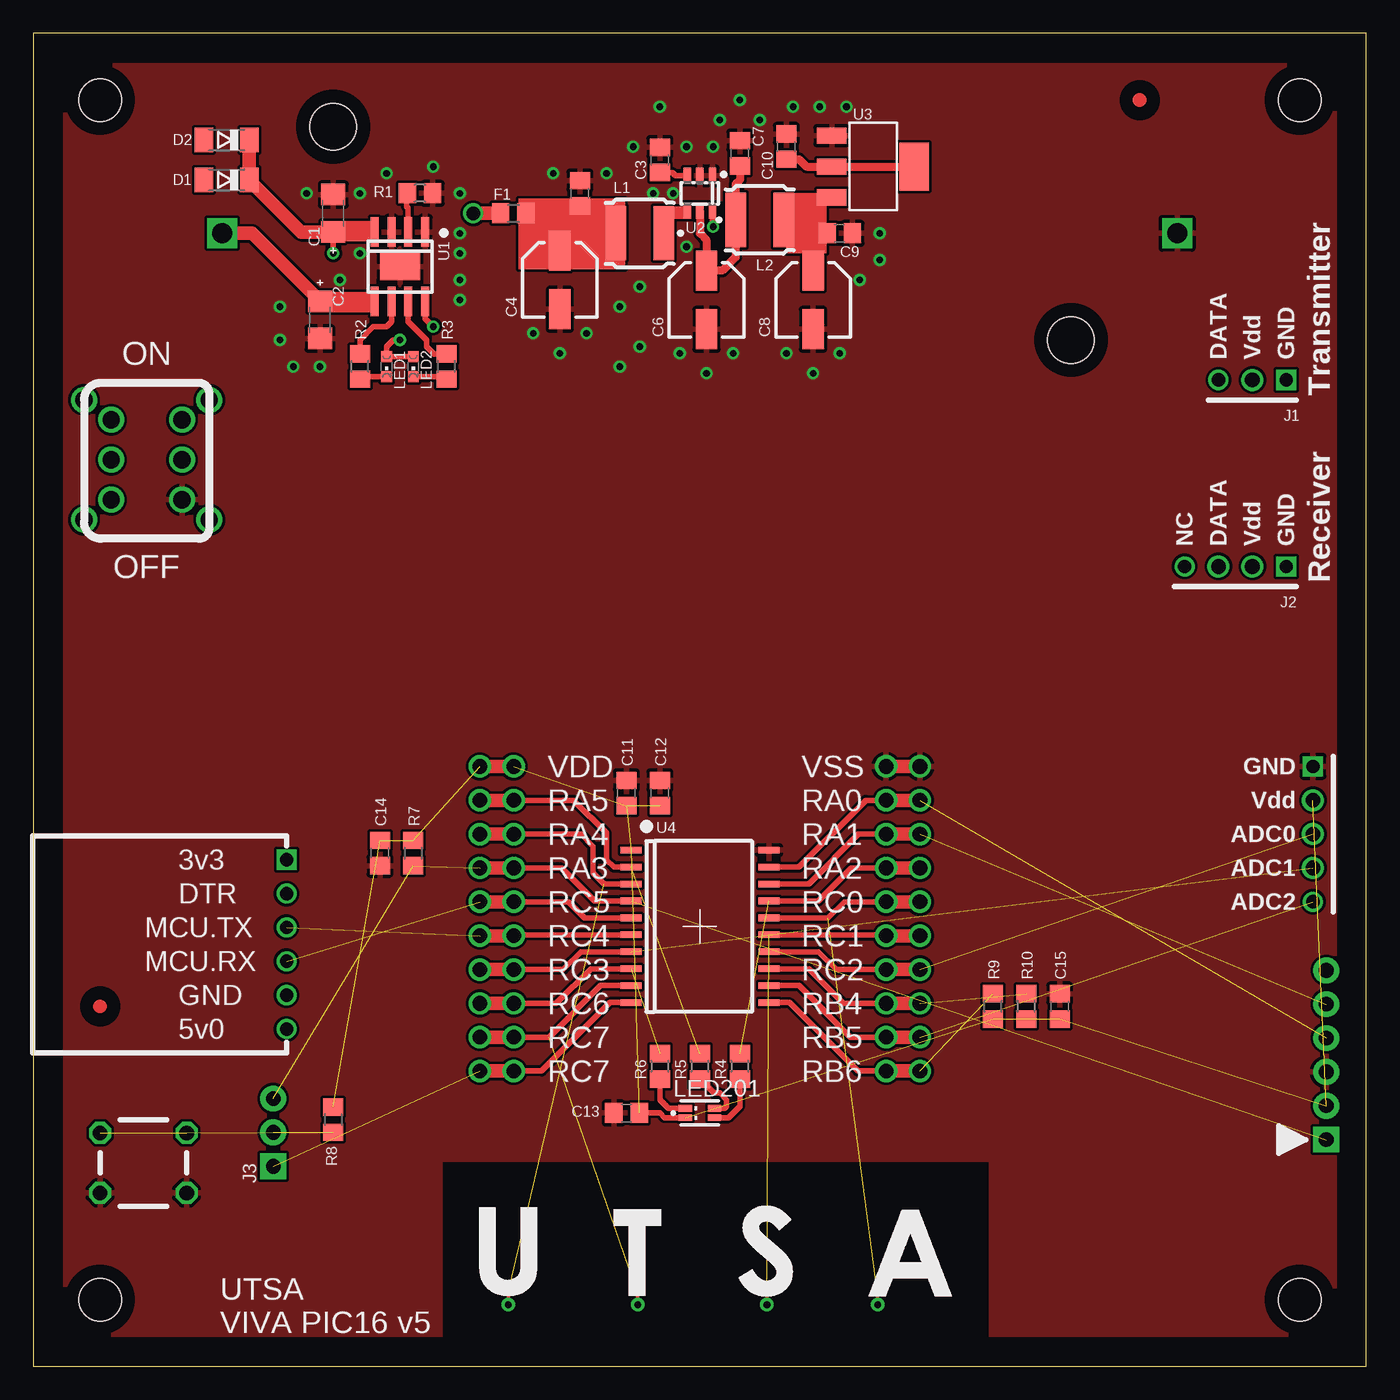
[diagram p8: board, top side]
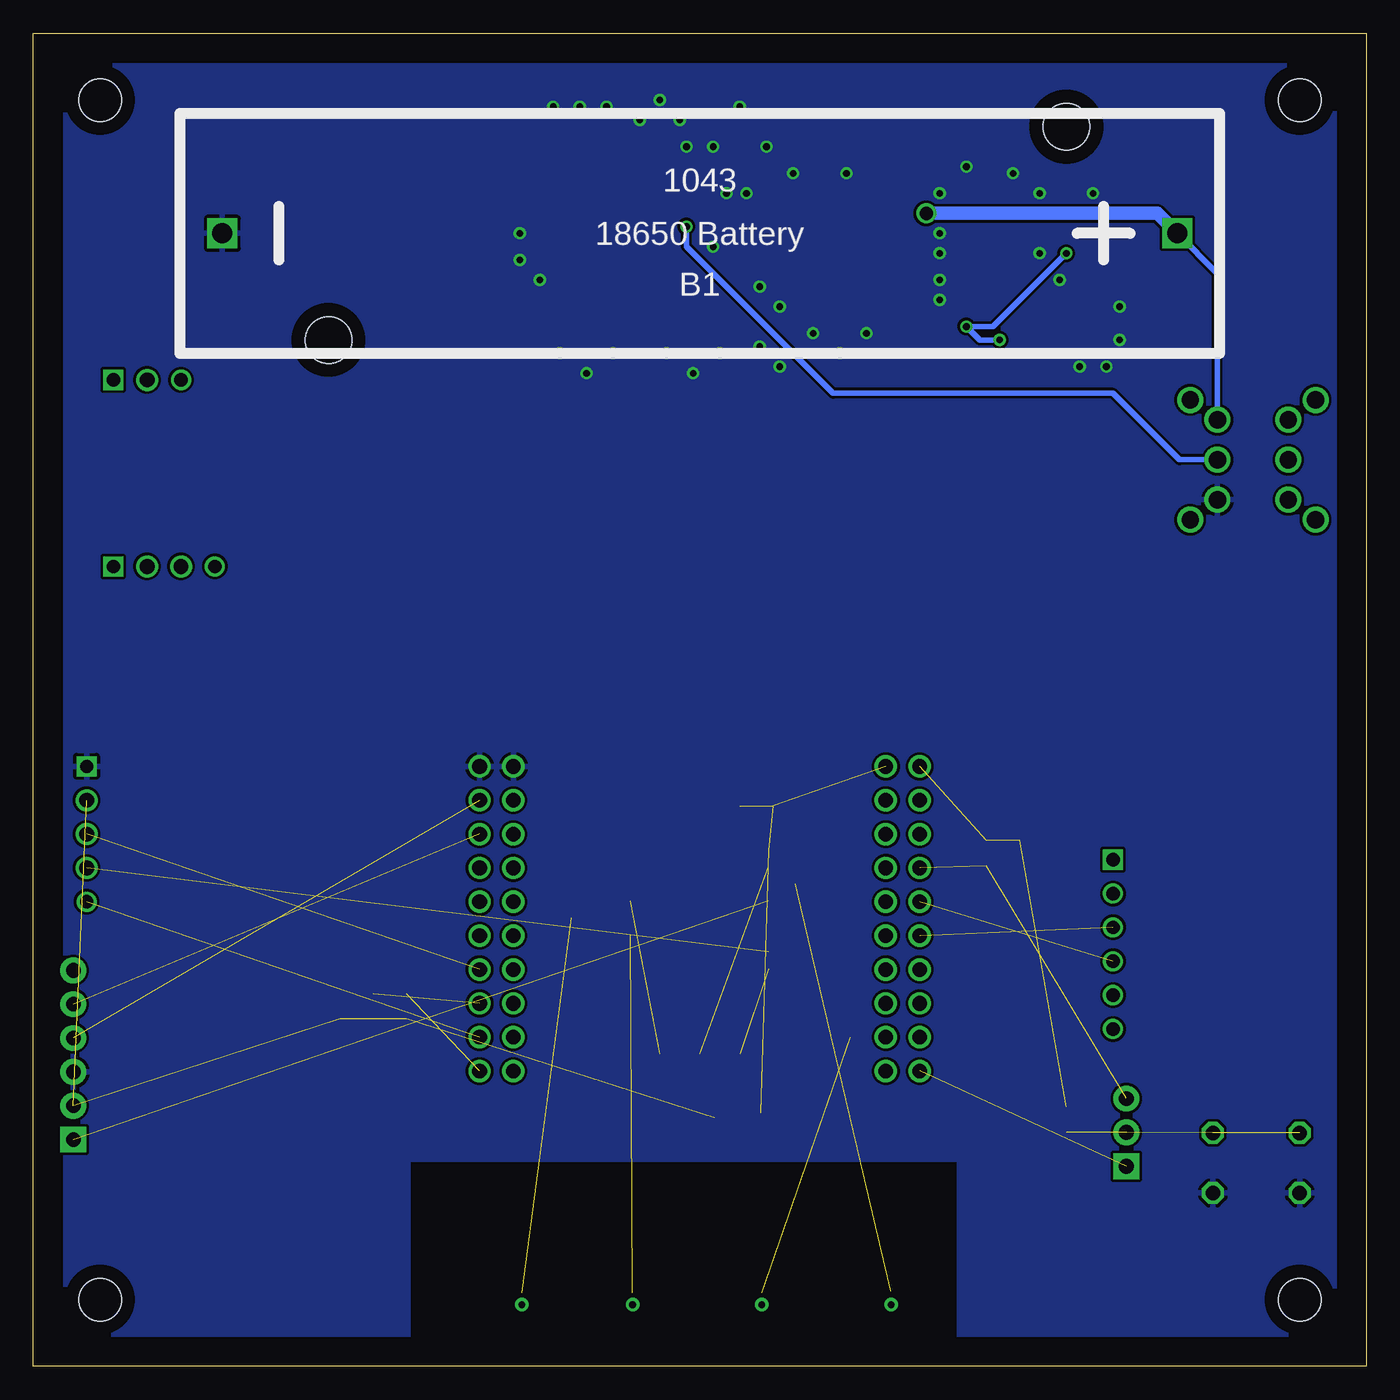
[diagram p9: board, bottom side, seen from below]

Size 100 x 100 mm. Coordinates in mm from the lower left corner, seen from the top.
Copper layers (1*16): Top 0.035mm / dielectric 1.5mm / Bottom 0.035mm
Design rules "default *": minimum track width 10mil, minimum drill 24mil, track to track 8mil, track to pad 8mil, pad to pad 8mil, via to via 8mil, smd to smd 8mil, copper to edge 40mil, drill to drill 8mil, minimum pad ring 10mil, minimum via ring 8mil, stop-mask expansion 4mil, vias tented up to drill 20mil, thermal gap 10mil

### Footprints (pad centres in the part's own frame; a part is rotated, then mirrored left to right if it is on the bottom)
BATTERY-18650-1 = drill 1.5 square: 1 35.82,0; + -35.82,0 | hole 3.5: -27.5,-8; 27.86,8
6X6MM = drill 1.1 octagon: 1.A 0,0; 2.A 6.5,0; 3.B 0,4.5; 4.B 6.5,4.5
C1206 = smd 1.6 x 1.8: + -1.4,0; - 1.4,0
C0805 = smd 1.3 x 1.5: 1 -0.95,0; 2 0.95,0
C-WE-5MM = smd 1.6 x 3: 1+ 0,2.2; 2- 0,-2.2
SOD80C = smd 1.4 x 1.8: A 1.7,0; C -1.7,0
F0805 = smd 1.3 x 1.5: 1 -0.95,0; 2 0.95,0
FIDUCIAL = smd 0 x 0: FIDUCIAL 0,0
VIVA-HEADER-GPIO-RA-1 = drill 1 square: 1 0,0 | drill 1.1: 2 0,-2.54 | drill 1: 3 0,-5.08
VIVA-HEADER-RF-RX = drill 1 square: 1 0,0 | drill 1.1: 2 0,-2.54; 3 0,-5.08 | drill 1: 4 0,-7.62
PINS_3 = drill 1.1 pad 1.93 square: 1 0,0 | drill 1.1 pad 1.93: 2 2.54,0; 3 5.08,0
VIVA-HEADER-ADC-NONAME = drill 1 square: 1 0,0 | drill 1.1: 2 2.54,0; 3 5.08,0; 4 7.62,0 | drill 1: 5 10.16,0
PICKIT3 = drill 1.1 pad 1.93 square: 1 0,0 | drill 1.1 pad 1.93: 2 2.54,0; 3 5.08,0; 4 7.62,0; 5 10.16,0; 6 12.7,0
SRN5040 = smd 1.524 x 4.064: 1 -1.803,0; 2 1.803,0
CHIPLED_0603 = smd 0.8 x 0.8: A 0,-0.75; C 0,0.75
LED_RGB-5050 = smd 1 x 0.5: 1.R- -1.1,0.35; 2.G- 1.1,0.35; 3.+ -1.1,-0.35; 4.B- 1.1,-0.35
R0805 = smd 1.3 x 1.5: 1 -0.95,0; 2 0.95,0
OS202013MT5QN1 = drill 1.3: 1 2.653,3.001; 2 2.653,0.004; 3 2.653,-2.993; 4 -2.655,3.001; 5 -2.655,0.004; 6 -2.655,-2.993; GND1 4.698,4.5; GND2 4.698,-4.492; GND3 -4.7,4.5; GND4 -4.7,-4.492
SO08-THERMAL = smd 0.6 x 2.2: 1 -1.905,-2.6; 2 -0.635,-2.6; 3 0.635,-2.6; 4 1.905,-2.6; 5 1.905,2.6; 6 0.635,2.6; 7 -0.635,2.6; 8 -1.905,2.6 | smd 3 x 2: THERMAL 0,0
SOT23-6 = smd 0.55 x 1.2: 1 -0.95,-1.3; 2 0,-1.3; 3 0.95,-1.3; 4 0.95,1.3; 5 0,1.3; 6 -0.95,1.3
SOT223 = smd 1.219 x 2.235: 1 -2.311,-3.099; 2 0,-3.099; 3 2.311,-3.099 | smd 3.6 x 2.2: 4.TAB 0,3.099
SOP20-NEW = smd 0.5 x 1.6: 1 -5.715,-5.152; 2 -4.445,-5.152; 3 -3.175,-5.152; 4 -1.905,-5.152; 5 -0.635,-5.152; 6 0.635,-5.152; 7 1.905,-5.152; 8 3.175,-5.152; 9 4.445,-5.152; 10 5.715,-5.152; 11 5.715,5.188; 12 4.445,5.188; 13 3.175,5.188; 14 1.905,5.188; 15 0.635,5.188; 16 -0.635,5.188; 17 -1.905,5.188; 18 -3.175,5.188; 19 -4.445,5.188; 20 -5.715,5.188
VIVA_PIC16 = drill 1.1 pad 1.676: 1.L 0,0; 1.R 2.54,0; 2.L 0,-2.54; 2.R 2.54,-2.54; 3.L 0,-5.08; 3.R 2.54,-5.08; 4.L 0,-7.62; 4.R 2.54,-7.62; 5.L 0,-10.16; 5.R 2.54,-10.16; 6.L 0,-12.7; 6.R 2.54,-12.7; 7.L 0,-15.24; 7.R 2.54,-15.24; 8.L 0,-17.78; 8.R 2.54,-17.78; 9.L 0,-20.32; 9.R 2.54,-20.32; 10.L 0,-22.86; 10.R 2.54,-22.86; 11.L 30.48,-22.86; 11.R 33.02,-22.86; 12.L 30.48,-20.32; 12.R 33.02,-20.32; 13.L 30.48,-17.78; 13.R 33.02,-17.78; 14.L 30.48,-15.24; 14.R 33.02,-15.24; 15.L 30.48,-12.7; 15.R 33.02,-12.7; 16.L 30.48,-10.16; 16.R 33.02,-10.16; 17.L 30.48,-7.62; 17.R 33.02,-7.62; 18.L 30.48,-5.08; 18.R 33.02,-5.08; 19.L 30.48,-2.54; 19.R 33.02,-2.54; 20.L 30.48,0; 20.R 33.02,0
VIVA_UTSA-KEYPAD-V5 = drill 0.5: 1 -14.36,3.11; 2 -4.66,3.11; 3 5.04,3.11; 4 13.34,3.11
VIVA_USB_TTL_SUBTEXT = drill 1 square: 1.3V3 0,0 | drill 1: 2.DTR 0,-2.54; 3.RXI 0,-5.08; 4.RDO 0,-7.62; 5.GND 0,-10.16; 6.5V 0,-12.7
PCB_100X100 = hole 3.2: 5,95; 95,95; 95,5; 5,5

### Placement (x,y rotation side)
B1  50,85 180 bottom
B201  5,13 0 top
C1  22.5,86.5 90 top
C2  21.5,78.5 270 top
C3  47,90.5 270 top
C4  39.5,81.5 0 top
C5  41,88 270 top
C6  50.5,80 0 top
C7  53,91 270 top
C8  58.5,80 0 top
C9  60.5,85 180 top
C10  56.5,91.5 270 top
C11  44.5,43 270 top
C12  47,43 270 top
C13  44.5,19 0 top
C14  26,38.5 90 top
C15  77,27 270 top
D1  14.5,89 180 top
D2  14.5,92 180 top
F1  36,86.5 0 top
FIDUCIAL1  83,95 0 top
FIDUCIAL2  5,27 0 top
J1  94,74 270 top
J2  94,60 270 top
J3  18,15 90 top
J202  96,45 270 top
J203  97,17 90 top
L1  45.5,85 0 top
L2  54.5,86 180 top
LED1  26.5,75 180 top
LED2  28.5,75 180 top
LED201  50,19 0 top
R1  29,88 180 top
R2  24.5,75 90 top
R3  31,75 90 top
R4  53,22.5 270 top
R5  50,22.5 270 top
R6  47,22.5 270 top
R7  28.5,38.5 270 top
R8  22.5,18.5 270 top
R9  72,27 90 top
R10  74.5,27 90 top
SW1.  8.5,68 0 top
U1  27.5,82.5 180 top
U2  50,88 180 top
U3  63,90 270 top
U4  50,33 270 top
U$6  33.5,45 0 top
U$7  50,1.5 0 top
U$11  19,38 0 top
UTSA  0,0 0 top

### Tracks (layer width: path | path; a pad name or v marks a point on that pad's centre or on a via)
+3V3
  Top 0.61: C10.2 57.45,90.55 58,90 U3.2 U3.4.TAB
+5V
  Top 0.61: L2.1 58.5,83.8 C8.1+ | C9.2 58.5,85.5 58,86 L2.1 | U3.3 58.69,87.69 57,86 L2.1
B+  (via drill 1)
  Top 0.406: C2.+ U1.5
  Top 1.016: B1.+ 16.4,85 C2.+ | F1.1 v33,86.5
  Bottom 0.406: SW1..1 11.15,81.97 B1.+
  Bottom 1.016: v33,86.5 15.68,86.5 B1.+
B+_FUSED
  Top 0.406: F1.2 39.5,83.95 C4.1+ 41,85.2 C5.2 43.05,85 L1.1
CHARGE
  Top 0.406: R3.2 30.05,75.95 29.5,76.5 29.5,77 28.14,78.36 U1.7
DCDC_ENABLE  (via drill 0.5)
  Top 0.406: U2.6 50.95,85.55 v51,85.5
  Bottom 0.406: SW1..2 14,68 19,73 40,73 51,84 v51,85.5
DCDC_OUT
  Top 0.61: U2.5 50,85 50.5,84.5 C6.1+ 51.7,82.2 52.7,83.2 L2.2 52.7,88.7 53,89 C7.2
DCDC_REF
  Top 0.406: U2.3 48.2,89.3 47.95,89.55 C3.2
GND  (via drill 0.5)
  other vias: 23,81.5 24.5,83.5 32,80 32,81.5 32,83.5 32,85 21.5,75 24.5,88 20.5,88 26.5,89.5 30,90 32,88 37.5,77.5 39.5,76 41.5,77.5 48.5,76 50.5,74.5 52.5,76 56.5,76 58.5,74.5 60.5,76 39,89.5 43,89.5 45,91.5 49,91.5 51,91.5 51.5,93.5 54.5,93.5 59,94.5 61,94.5 57,94.5 63.5,85 63.5,83 62,81.5 45.5,81 44,79.5 49,84 48,88 46.5,88 44,75 45.5,76.5 19.5,75 18.5,77 18.5,79.5 47,94.5 53,95
  pour Top: 2,2 98,2 98,98 2,98
  pour Bottom: 2,2 98,2 98,98 2,98
ICSP_CLK  (1 unrouted)
  Top 0.406: U$6.18.L 61.92,39.92 58.17,36.17 U4.18
ICSP_DAT  (1 unrouted)
  Top 0.406: U$6.19.L 62.46,42.46 57.45,37.45 U4.19
MCLR  (3 unrouted)
  Top 0.406: U$6.4.R 39.62,37.38 42.09,34.91 U4.4
N$1  (3 unrouted)
N$2
  Top 0.406: R2.1 24.7,74.25 LED1.C
N$3
  Top 0.406: LED2.C 30.8,74.25 arc-90 R3.1
N$4
  Top 0.406: LED201.2.G- 51.85,19.35 52,19.5 52,20 51.5,20.5 51.05,20.5 R5.2
N$5
  Top 0.406: LED201.1.R- 47.65,19.35 47,20 R6.2
N$6
  Top 0.406: LED201.4.B- 52.15,18.65 53,19.5 R4.2
N$7
  Top 0.406: R1.2 28,87.95 28,87 28.14,86.86 U1.2
RA2  (1 unrouted)
  Top 0.406: U4.17 58.91,34.91 61.38,37.38 U$6.17.L
RA4  (1 unrouted)
  Top 0.406: U$6.3.R 41.08,39.92 42,39 42,37 42.83,36.17 U4.3
RA5  (1 unrouted)
  Top 0.406: U$6.2.R 40.54,42.46 43,40 43,38 43.55,37.45 U4.2
RB4  (1 unrouted)
  Top 0.406: U$6.13.L 60.78,27.22 58.17,29.82 U4.13
RB5  (1 unrouted)
  Top 0.406: U$6.12.L 61.32,24.68 57.45,28.55 U4.12
RB6  (1 unrouted)
  Top 0.406: U$6.11.L 61.86,22.14 56.72,27.29 U4.11
RB7  (1 unrouted)
  Top 0.406: U$6.10.R 38.14,22.14 43.28,27.29 U4.10
RC0  (1 unrouted)
  Top 0.406: U$6.16.L 60.84,34.84 59.63,33.63 U4.16
RC1  (1 unrouted)
  Top 0.406: 63.98,32.37 U$6.15.L arc90 63.91,32.37 U4.15
RC2  (1 unrouted)
  Top 0.406: U$6.14.L 60.24,29.76 58.91,31.09 U4.14
RC3  (1 unrouted)
  Top 0.406: U$6.7.R 39.76,29.76 41.09,31.09 U4.7
RC4  (1 unrouted)
  Top 0.406: 36.1,32.37 U$6.6.R arc-90 36.1,32.37 | U4.6 36.1,32.37
RC5  (1 unrouted)
  Top 0.406: U$6.5.R 40.16,34.84 41.37,33.63 U4.5
RC6  (1 unrouted)
  Top 0.406: U$6.8.R 39.22,27.22 41.83,29.82 U4.8
RC7  (1 unrouted)
  Top 0.406: U$6.9.R 38.68,24.68 42.55,28.55 U4.9
STANDBY
  Top 0.406: U1.6 26.86,78.36 26.5,78 25.5,78 24.5,77 R2.2
SWITCH_NODE
  Top 0.406: U2.4 48,86.7 47.5,86.2 L1.2
VCC  (via drill 0.5)
  Top 0.406: U1.8 29.41,78.59 v30,78 | v22.5,83.5 C1.+ U1.4 | LED2.A LED1.A 26.5,76.5 27,77 v27.5,77
  Top 1.016: D2.C D1.C 20.1,85.1 C1.+
  Bottom 0.406: v22.5,83.5 28,78 v30,78 29,77 v27.5,77
VDD  (12 unrouted)
  Top 0.406: LED201.3.+ 47.35,18.65 47,19 C13.2
(copper drawn outside any net)
  shapes: Top area x5